# EAGLE design SwitchEthernet - Rev A6 (EAGLE 7.7.0)

## Sheet 1 of 2
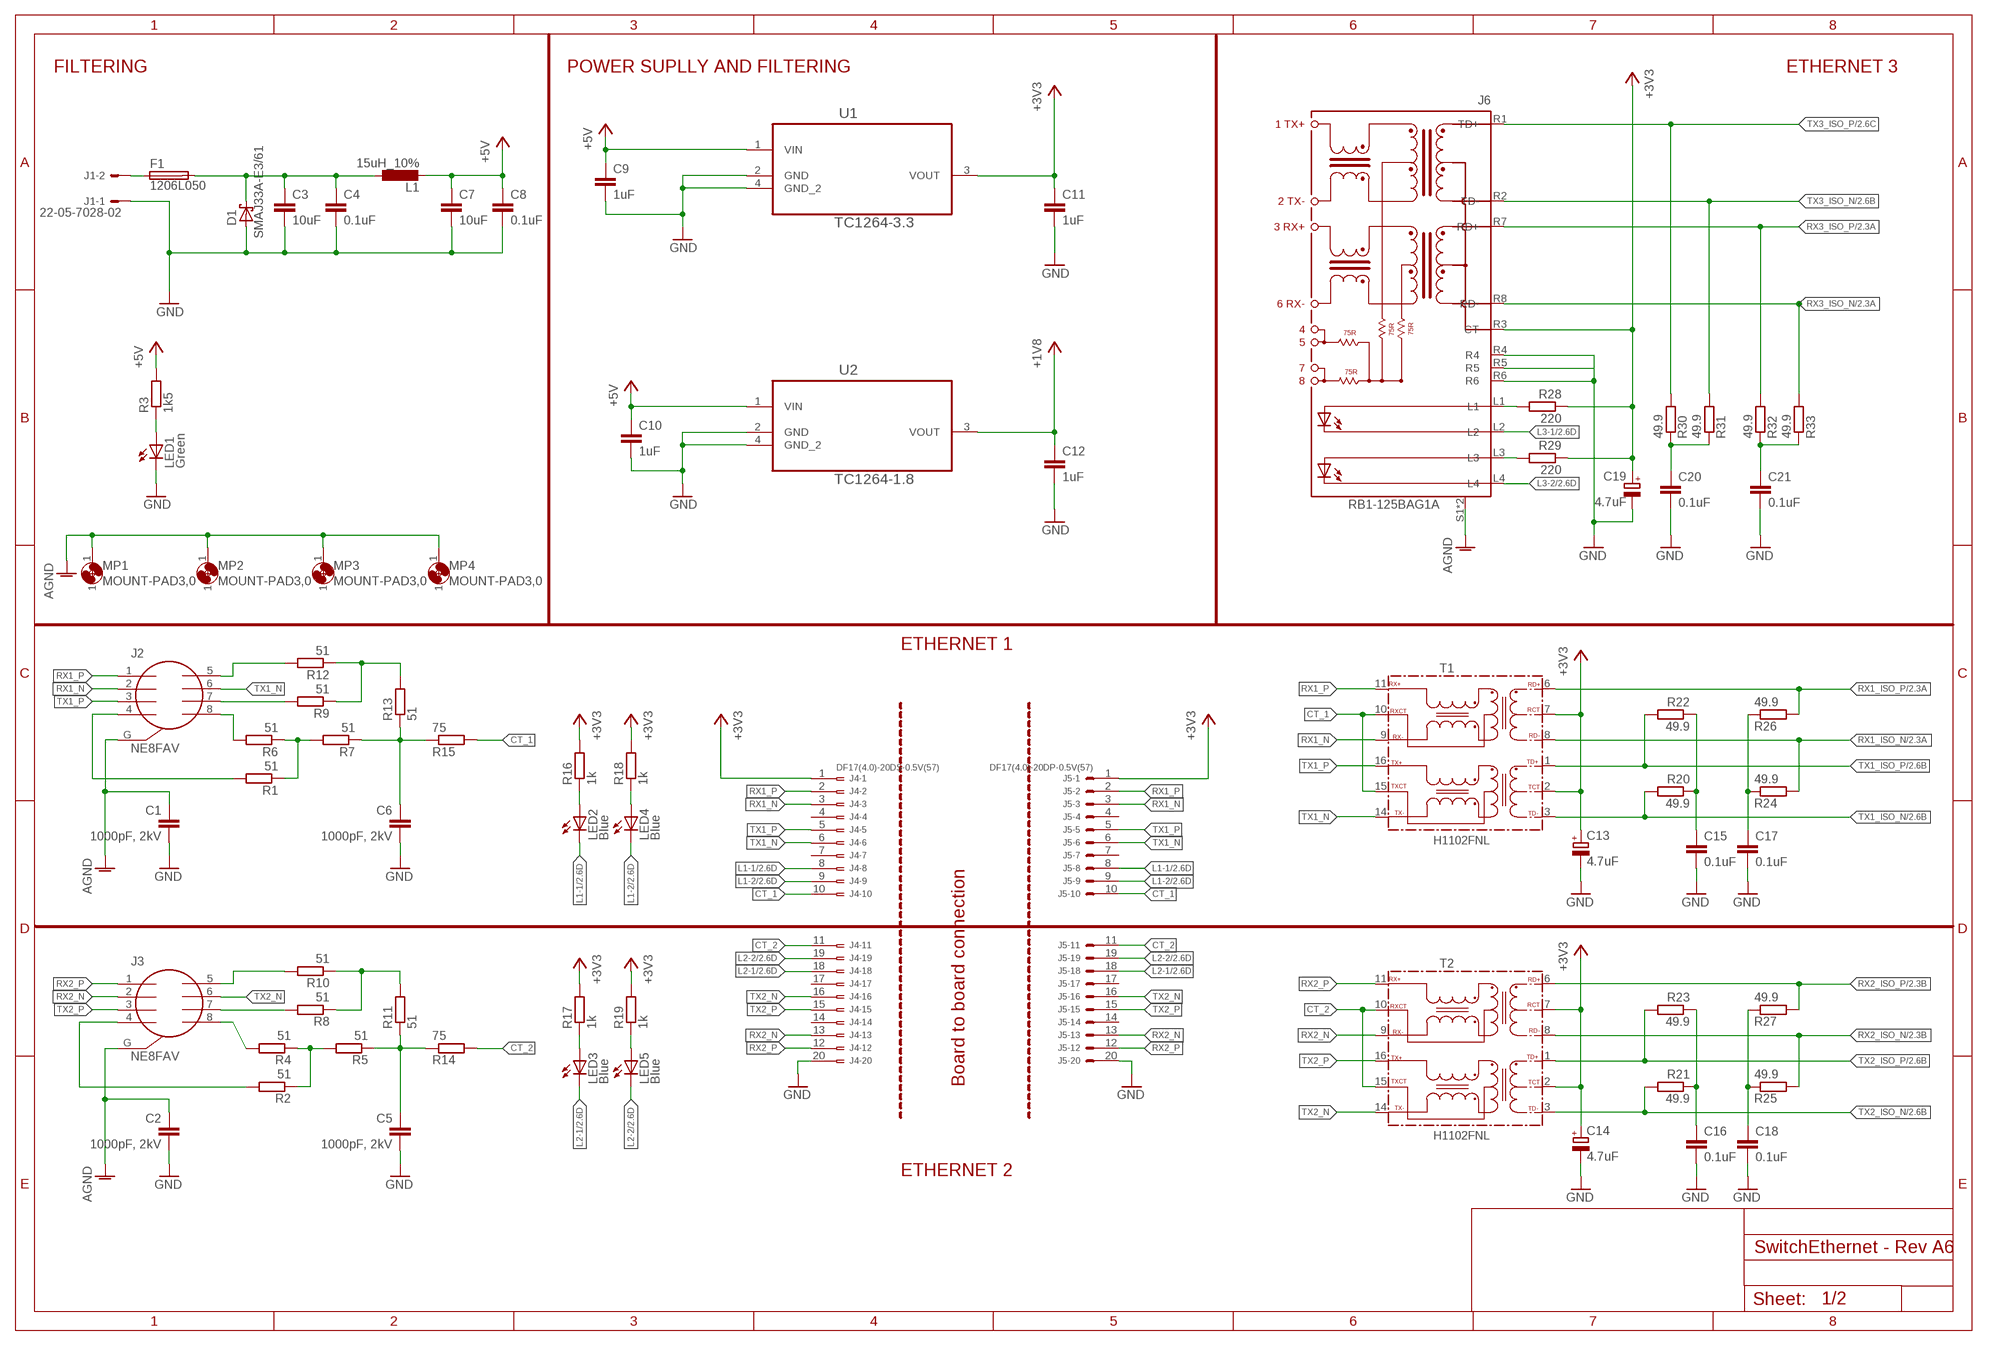
[diagram p0: schematic, sheet 1]

### Parts
C1  1000pF, 2kV  C-EUC1206  [C1206]
C2  1000pF, 2kV  C-EUC1206  [C1206]
C3  10uF  C-EUC0603  [C0603]
C4  0.1uF  C-EUC0603  [C0603]
C5  1000pF, 2kV  C-EUC1206  [C1206]
C6  1000pF, 2kV  C-EUC1206  [C1206]
C7  10uF  C-EUC0603  [C0603]
C8  0.1uF  C-EUC0603  [C0603]
C9  1uF  C-EUC0603  [C0603]
C10  1uF  C-EUC0603  [C0603]
C11  1uF  C-EUC0603  [C0603]
C12  1uF  C-EUC0603  [C0603]
C13  4.7uF  CPOL-EUCT3216  [CT3216]
C14  4.7uF  CPOL-EUCT3216  [CT3216]
C15  0.1uF  C-EUC0603  [C0603]
C16  0.1uF  C-EUC0603  [C0603]
C17  0.1uF  C-EUC0603  [C0603]
C18  0.1uF  C-EUC0603  [C0603]
C19  4.7uF  CPOL-EUCT3216  [CT3216]
C20  0.1uF  C-EUC0603  [C0603]
C21  0.1uF  C-EUC0603  [C0603]
D1  SMAJ33A-E3/61  [DIODE_DO-214AC]
F1  1206L050  [1206L]
J1  22-05-7028-02  [7395-02]
J2  NE8FAV  [NE8FAV]
J3  NE8FAV  [NE8FAV]
J4  DF17(4.0)-20DS-0.5V(57)  [DF17-20DS]
J5  DF17(4.0)-20DP-0.5V(57)  [DF17-20DP]
J6  RB1-125BAG1A  [WIZNET_RB1-125BAG1A]
L1  15uH_10%  L-EUL4532C  [L4532M]
LED1  Green  LEDCHIP-LED0603  [CHIP-LED0603]
LED2  Blue  LEDCHIP-LED0603  [CHIP-LED0603]
LED3  Blue  LEDCHIP-LED0603  [CHIP-LED0603]
LED4  Blue  LEDCHIP-LED0603  [CHIP-LED0603]
LED5  Blue  LEDCHIP-LED0603  [CHIP-LED0603]
MP1  MOUNT-PAD3,0  [P3,0]
MP2  MOUNT-PAD3,0  [P3,0]
MP3  MOUNT-PAD3,0  [P3,0]
MP4  MOUNT-PAD3,0  [P3,0]
R1  51  R-EU_R0603  [R0603]
R2  51  R-EU_R0603  [R0603]
R3  1k5  R-EU_R0603  [R0603]
R4  51  R-EU_R0603  [R0603]
R5  51  R-EU_R0603  [R0603]
R6  51  R-EU_R0603  [R0603]
R7  51  R-EU_R0603  [R0603]
R8  51  R-EU_R0603  [R0603]
R9  51  R-EU_R0603  [R0603]
R10  51  R-EU_R0603  [R0603]
R11  51  R-EU_R0603  [R0603]
R12  51  R-EU_R0603  [R0603]
R13  51  R-EU_R0603  [R0603]
R14  75  R-EU_R0603  [R0603]
R15  75  R-EU_R0603  [R0603]
R16  1k  R-EU_R0603  [R0603]
R17  1k  R-EU_R0603  [R0603]
R18  1k  R-EU_R0603  [R0603]
R19  1k  R-EU_R0603  [R0603]
R20  49.9  R-EU_R0603  [R0603]
R21  49.9  R-EU_R0603  [R0603]
R22  49.9  R-EU_R0603  [R0603]
R23  49.9  R-EU_R0603  [R0603]
R24  49.9  R-EU_R0603  [R0603]
R25  49.9  R-EU_R0603  [R0603]
R26  49.9  R-EU_R0603  [R0603]
R27  49.9  R-EU_R0603  [R0603]
R28  220  R-EU_R0603  [R0603]
R29  220  R-EU_R0603  [R0603]
R30  49.9  R-EU_R0603  [R0603]
R31  49.9  R-EU_R0603  [R0603]
R32  49.9  R-EU_R0603  [R0603]
R33  49.9  R-EU_R0603  [R0603]
T1  H1102FNL  [HXXXX]
T2  H1102FNL  [HXXXX]
U1  TC1264-3.3  [SOT230P700X180-4N]
U2  TC1264-1.8  [SOT230P700X180-4N]

### Nets
+1V8: C12.1 U2.3(VOUT) ; also sheet 2
+3V3: C11.1 C13.+ C14.+ C19.+ J4.1 J5.1 J6.R3(CT) R16.2 R17.2 R18.2 R19.2 R28.1 R29.1 T1.2(TCT) T1.7(RCT) T2.2(TCT) T2.7(RCT) U1.3(VOUT) ; also sheet 2
+5V: C7.1 C8.1 C9.1 C10.1 L1.2 R3.2 U1.1(VIN) U2.1(VIN)
AGND: C1.1 C2.1 J2.G J3.G J6.S1 J6.S2 MP1.1 MP2.1 MP3.1 MP4.1
CT_1: J4.10 J5.10 R15.2 T1.10(RXCT) T1.15(TXCT)
CT_2: J4.11 J5.11 R14.2 T2.10(RXCT) T2.15(TXCT)
GND: C1.2 C2.2 C3.2 C4.2 C5.2 C6.2 C7.2 C8.2 C9.2 C10.2 C11.2 C12.2 C13.- C14.- C15.2 C16.2 C17.2 C18.2 C19.- C20.2 C21.2 D1.2(A) J1.1 J4.20 J5.20 J6.R4 J6.R5 J6.R6 LED1.C U1.2(GND) U1.4(GND_2) U2.2(GND) U2.4(GND_2) ; also sheet 2
L1-1: J4.8 J5.8 LED2.C ; also sheet 2
L1-2: J4.9 J5.9 LED4.C ; also sheet 2
L2-1: J4.18 J5.18 LED3.C ; also sheet 2
L2-2: J4.19 J5.19 LED5.C ; also sheet 2
L3-1: J6.L2 ; also sheet 2
L3-2: J6.L4 ; also sheet 2
N$2: F1.1 J1.2
N$5: J3.8 R4.2
N$7: J2.4 R1.2
N$8: J2.8 R6.2
N$9: J2.7 R9.2
N$10: C15.1 R20.1 R22.1
N$11: J2.5 R12.2
N$12: J3.7 R8.2
N$13: C5.1 R5.1 R11.1 R14.1
N$14: R1.1 R6.1 R7.2
N$15: J3.4 R2.2
N$16: R2.1 R4.1 R5.2
N$17: R9.1 R12.1 R13.2
N$18: J3.5 R10.2
N$19: R8.1 R10.1 R11.2
N$20: LED2.A R16.1
N$23: LED1.A R3.1
N$27: C20.1 R30.1 R31.1
N$28: LED4.A R18.1
N$29: LED3.A R17.1
N$30: LED5.A R19.1
N$31: C21.1 R32.1 R33.1
N$32: C6.1 R7.1 R13.1 R15.1
N$33: C17.1 R24.1 R26.1
N$34: J6.L3 R29.2
N$35: J6.L1 R28.2
N$40: C16.1 R21.1 R23.1
N$41: C18.1 R25.1 R27.1
PW: C3.1 C4.1 D1.1(C) F1.2 L1.1
RX1_ISO_N: R24.2 T1.8(RD-) ; also sheet 2
RX1_ISO_P: R26.2 T1.6(RD+) ; also sheet 2
RX1_N: J2.2 J4.3 J5.3 T1.9(RX-)
RX1_P: J2.1 J4.2 J5.2 T1.11(RX+)
RX2_ISO_N: R25.2 T2.8(RD-) ; also sheet 2
RX2_ISO_P: R27.2 T2.6(RD+) ; also sheet 2
RX2_N: J3.2 J4.13 J5.13 T2.9(RX-)
RX2_P: J3.1 J4.12 J5.12 T2.11(RX+)
RX3_ISO_N: J6.R8(RD-) R33.2 ; also sheet 2
RX3_ISO_P: J6.R7(RD+) R32.2 ; also sheet 2
TX1_ISO_N: R20.2 T1.3(TD-) ; also sheet 2
TX1_ISO_P: R22.2 T1.1(TD+) ; also sheet 2
TX1_N: J2.6 J4.6 J5.6 T1.14(TX-)
TX1_P: J2.3 J4.5 J5.5 T1.16(TX+)
TX2_ISO_N: R21.2 T2.3(TD-) ; also sheet 2
TX2_ISO_P: R23.2 T2.1(TD+) ; also sheet 2
TX2_N: J3.6 J4.16 J5.16 T2.14(TX-)
TX2_P: J3.3 J4.15 J5.15 T2.16(TX+)
TX3_ISO_N: J6.R2(TD-) R31.2 ; also sheet 2
TX3_ISO_P: J6.R1(TD+) R30.2 ; also sheet 2
Unconnected: J4.4 J4.7 J4.14 J4.17 J5.4 J5.7 J5.14 J5.17

### Notes on the sheet
- FILTERING | POWER SUPLLY AND FILTERING | ETHERNET 3
- ETHERNET 1
- Board to board connection
- ETHERNET 2

## Sheet 2 of 2
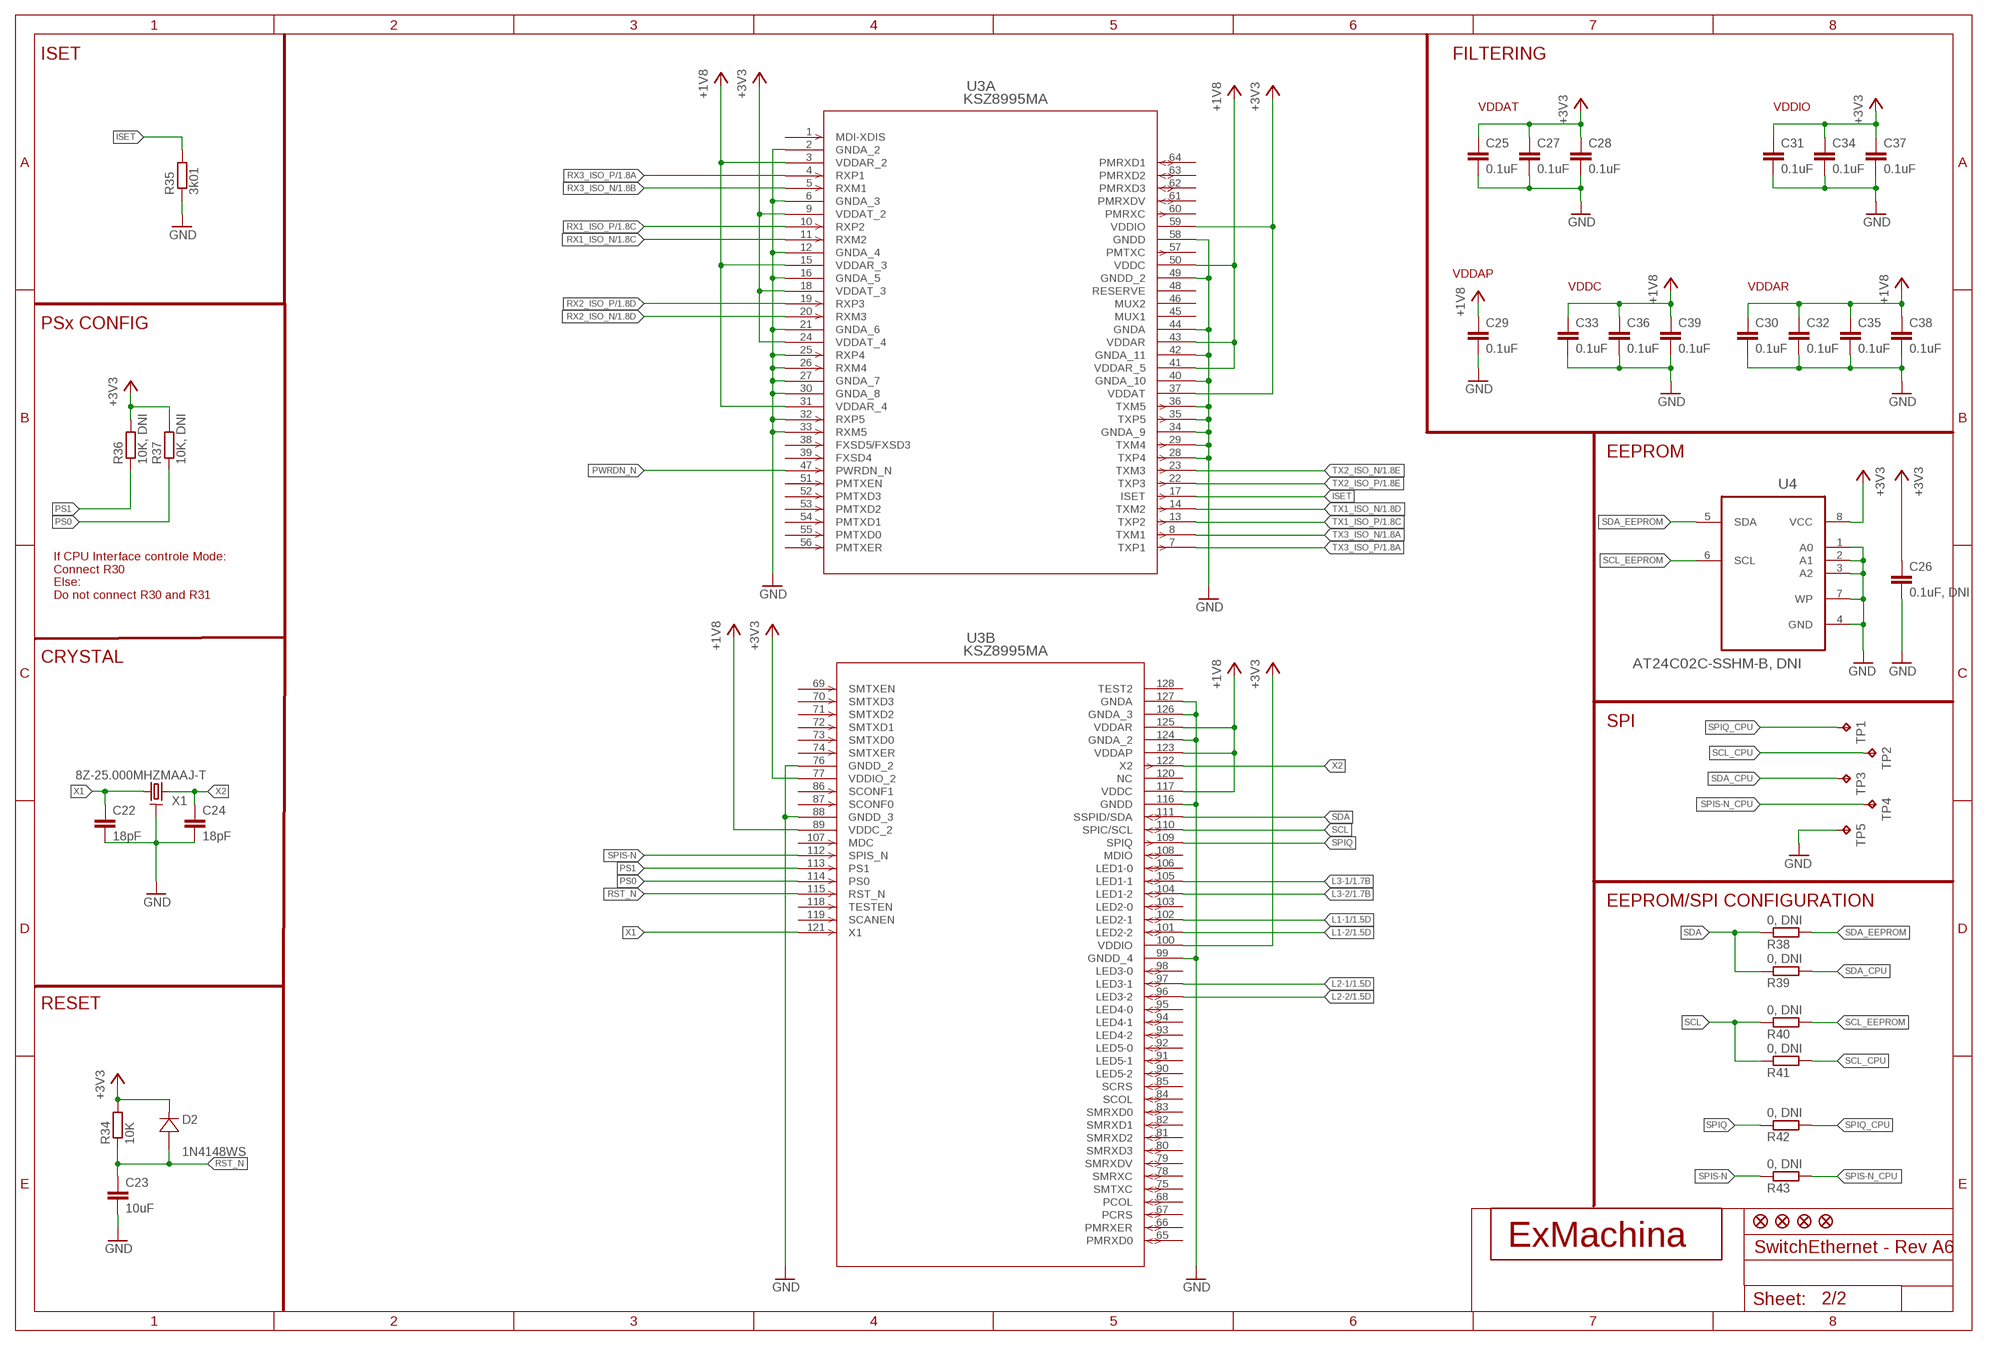
[diagram p1: schematic, sheet 2]

### Parts
C22  18pF  C-EUC0603  [C0603]
C23  10uF  C-EUC0603  [C0603]
C24  18pF  C-EUC0603  [C0603]
C25  0.1uF  C-EUC0603  [C0603]
C26  0.1uF, DNI  C-EUC0603  [C0603]
C27  0.1uF  C-EUC0603  [C0603]
C28  0.1uF  C-EUC0603  [C0603]
C29  0.1uF  C-EUC0603  [C0603]
C30  0.1uF  C-EUC0603  [C0603]
C31  0.1uF  C-EUC0603  [C0603]
C32  0.1uF  C-EUC0603  [C0603]
C33  0.1uF  C-EUC0603  [C0603]
C34  0.1uF  C-EUC0603  [C0603]
C35  0.1uF  C-EUC0603  [C0603]
C36  0.1uF  C-EUC0603  [C0603]
C37  0.1uF  C-EUC0603  [C0603]
C38  0.1uF  C-EUC0603  [C0603]
C39  0.1uF  C-EUC0603  [C0603]
D2  1N4148WS  [SOD323-W]
JP1  FIDUCIAL1X2  [FIDUCIAL-1X2]
JP2  FIDUCIAL1X2  [FIDUCIAL-1X2]
JP3  FIDUCIAL1X2  [FIDUCIAL-1X2]
JP4  FIDUCIAL1X2  [FIDUCIAL-1X2]
R34  10K  R-EU_R0603  [R0603]
R35  3k01  R-EU_R0603  [R0603]
R36  10K, DNI  R-EU_R0603  [R0603]
R37  10K, DNI  R-EU_R0603  [R0603]
R38  0, DNI  R-EU_R0603  [R0603]
R39  0, DNI  R-EU_R0603  [R0603]
R40  0, DNI  R-EU_R0603  [R0603]
R41  0, DNI  R-EU_R0603  [R0603]
R42  0, DNI  R-EU_R0603  [R0603]
R43  0, DNI  R-EU_R0603  [R0603]
T3  EXMACHINA-LOGO-NAME  [EXM-LOGO-BASELINE]
TP1  TPB1,27  [B1,27]
TP2  TPB1,27  [B1,27]
TP3  TPB1,27  [B1,27]
TP4  TPB1,27  [B1,27]
TP5  TPB1,27  [B1,27]
U3  KSZ8995MA  [PQFP-128_MQL]
U4  AT24C02C-SSHM-B, DNI  AT24C02C-SSHM-B  [SOIC127P600X175-8N]
X1  8Z-25.000MHZMAAJ-T  [SMD2.5X2]

### Nets
+1V8: C29.1 C30.1 C32.1 C33.1 C35.1 C36.1 C38.1 C39.1 U3.3(A:VDDAR_2) U3.15(A:VDDAR_3) U3.31(A:VDDAR_4) U3.41(A:VDDAR_5) U3.43(A:VDDAR) U3.50(A:VDDC) U3.89(B:VDDC_2) U3.117(B:VDDC) U3.123(B:VDDAP) U3.125(B:VDDAR) ; also sheet 1
+3V3: C25.1 C26.1 C27.1 C28.1 C31.1 C34.1 C37.1 D2.C R34.2 R36.2 R37.2 U3.9(A:VDDAT_2) U3.18(A:VDDAT_3) U3.24(A:VDDAT_4) U3.37(A:VDDAT) U3.59(A:VDDIO) U3.77(B:VDDIO_2) U3.100(B:VDDIO) U4.8(VCC) ; also sheet 1
GND: C22.2 C23.2 C24.2 C25.2 C26.2 C27.2 C28.2 C29.2 C30.2 C31.2 C32.2 C33.2 C34.2 C35.2 C36.2 C37.2 C38.2 C39.2 R35.1 TP5.TP U3.2(A:GNDA_2) U3.6(A:GNDA_3) U3.12(A:GNDA_4) U3.16(A:GNDA_5) U3.21(A:GNDA_6) U3.25(A:RXP4) U3.26(A:RXM4) U3.27(A:GNDA_7) U3.28(A:TXP4) U3.29(A:TXM4) U3.30(A:GNDA_8) U3.32(A:RXP5) U3.33(A:RXM5) U3.34(A:GNDA_9) U3.35(A:TXP5) U3.36(A:TXM5) U3.40(A:GNDA_10) U3.42(A:GNDA_11) U3.44(A:GNDA) U3.49(A:GNDD_2) U3.58(A:GNDD) U3.76(B:GNDD_2) U3.88(B:GNDD_3) U3.99(B:GNDD_4) U3.116(B:GNDD) U3.124(B:GNDA_2) U3.126(B:GNDA_3) U3.127(B:GNDA) U4.1(A0) U4.2(A1) U4.3(A2) U4.4(GND) U4.7(WP) X1.2 X1.4 ; also sheet 1
ISET: R35.2 U3.17(A:ISET)
L1-1: U3.102(B:LED2-1) ; also sheet 1
L1-2: U3.101(B:LED2-2) ; also sheet 1
L2-1: U3.97(B:LED3-1) ; also sheet 1
L2-2: U3.96(B:LED3-2) ; also sheet 1
L3-1: U3.105(B:LED1-1) ; also sheet 1
L3-2: U3.104(B:LED1-2) ; also sheet 1
PS0: R37.1 U3.114(B:PS0)
PS1: R36.1 U3.113(B:PS1)
PWRDN_N: U3.47(A:PWRDN_N)
RST_N: C23.1 D2.A R34.1 U3.115(B:RST_N)
RX1_ISO_N: U3.11(A:RXM2) ; also sheet 1
RX1_ISO_P: U3.10(A:RXP2) ; also sheet 1
RX2_ISO_N: U3.20(A:RXM3) ; also sheet 1
RX2_ISO_P: U3.19(A:RXP3) ; also sheet 1
RX3_ISO_N: U3.5(A:RXM1) ; also sheet 1
RX3_ISO_P: U3.4(A:RXP1) ; also sheet 1
SCL: R40.1 R41.1 U3.110(B:SPIC/SCL)
SCL_CPU: R41.2 TP2.TP
SCL_EEPROM: R40.2 U4.6(SCL)
SDA: R38.1 R39.1 U3.111(B:SSPID/SDA)
SDA_CPU: R39.2 TP3.TP
SDA_EEPROM: R38.2 U4.5(SDA)
SPIQ: R42.1 U3.109(B:SPIQ)
SPIQ_CPU: R42.2 TP1.TP
SPIS-N: R43.1 U3.112(B:SPIS_N)
SPIS-N_CPU: R43.2 TP4.TP
TX1_ISO_N: U3.14(A:TXM2) ; also sheet 1
TX1_ISO_P: U3.13(A:TXP2) ; also sheet 1
TX2_ISO_N: U3.23(A:TXM3) ; also sheet 1
TX2_ISO_P: U3.22(A:TXP3) ; also sheet 1
TX3_ISO_N: U3.8(A:TXM1) ; also sheet 1
TX3_ISO_P: U3.7(A:TXP1) ; also sheet 1
X1: C22.1 U3.121(B:X1) X1.1
X2: C24.1 U3.122(B:X2) X1.3
Unconnected: U3.1(A:MDI-XDIS) U3.38(A:FXSD5/FXSD3) U3.39(A:FXSD4) U3.45(A:MUX1) U3.46(A:MUX2) U3.48(A:RESERVE) U3.51(A:PMTXEN) U3.52(A:PMTXD3) U3.53(A:PMTXD2) U3.54(A:PMTXD1) U3.55(A:PMTXD0) U3.56(A:PMTXER) U3.57(A:PMTXC) U3.60(A:PMRXC) U3.61(A:PMRXDV) U3.62(A:PMRXD3) U3.63(A:PMRXD2) U3.64(A:PMRXD1) U3.65(B:PMRXD0) U3.66(B:PMRXER) U3.67(B:PCRS) U3.68(B:PCOL) U3.69(B:SMTXEN) U3.70(B:SMTXD3) U3.71(B:SMTXD2) U3.72(B:SMTXD1) U3.73(B:SMTXD0) U3.74(B:SMTXER) U3.75(B:SMTXC) U3.78(B:SMRXC) U3.79(B:SMRXDV) U3.80(B:SMRXD3) U3.81(B:SMRXD2) U3.82(B:SMRXD1) U3.83(B:SMRXD0) U3.84(B:SCOL) U3.85(B:SCRS) U3.86(B:SCONF1) U3.87(B:SCONF0) U3.90(B:LED5-2) U3.91(B:LED5-1) U3.92(B:LED5-0) U3.93(B:LED4-2) U3.94(B:LED4-1) U3.95(B:LED4-0) U3.98(B:LED3-0) U3.103(B:LED2-0) U3.106(B:LED1-0) U3.107(B:MDC) U3.108(B:MDIO) U3.118(B:TESTEN) U3.119(B:SCANEN) U3.120(B:NC) U3.128(B:TEST2)

### Notes on the sheet
- ISET | FILTERING
- VDDAT | VDDIO
- VDDAP
- VDDC | VDDAR
- PSx CONFIG
- EEPROM
- If CPU Interface controle Mode:
  Connect R30
  Else:
  Do not connect R30 and R31
- CRYSTAL
- SPI
- EEPROM/SPI CONFIGURATION
- RESET

## Library data of the parts
C1 C2 C5 C6 = rcl:C-EU: CAPACITOR, European symbol; MF: MULTICOMP; MPN: MC1206B102K202CT; OC_FARNELL: 1855909; OC_NEWARK: unknown
C3 C7 C23 = rcl:C-EU: CAPACITOR, European symbol; MF: MURATA; MPN: GRM32DR71C106KA01L; OC_FARNELL: 2494299; OC_NEWARK: unknown
C4 C8 C15-C18 C20 C21 C25-C39 = rcl:C-EU: CAPACITOR, European symbol; MF: MURATA; MPN: GRM188R71H104KA93D; OC_FARNELL: 8820023; OC_NEWARK: unknown
C9-C12 = rcl:C-EU: CAPACITOR, European symbol; MF: MURATA; MPN: GRM188R61C105KA93D; OC_FARNELL: 1828801; OC_NEWARK: unknown
C13 C14 C19 = rcl:CPOL-EU: POLARIZED CAPACITOR, European symbol; MF: KEMET; MPN: T491A475K016AT; OC_FARNELL: 1457428; OC_NEWARK: unknown
C22 C24 = rcl:C-EU: CAPACITOR, European symbol; MF: MURATA; MPN: GRM1885C1H180JA01D; OC_FARNELL: 1828908; OC_NEWARK: unknown
D1 = diode:SMAJ33A-E3/61; MF: VISHAY; MPN: SMAJ33A-E3/61; OC_FARNELL: 9550909; OC_NEWARK: unknown
D2 = diode:1N4148WS; MF: ON SEMICONDUCTOR; MPN: 1N4148WS; OC_FARNELL: 2453269; OC_NEWARK: unknown
F1 = fuse2:1206L: 1206L Series - POLYFUSE® Lead-Free Surface Mount Resettable PPTC; MF: LITTELFUSE; MPN: 1206L050YR; OC_FARNELL: 1596993; OC_NEWARK: unknown
J1 = con-molex:22-?-02: CONNECTOR wire to board 2.54 mm (.1 inch) pitch header; MF: MOLEX; MPN: 22-05-7028; OC_FARNELL: 9731601; OC_NEWARK: unknown
J2 J3 = con-neutrik_ag:NE8; MF: NEUTRIK; MPN: NE8FAV; OC_FARNELL: 1202031; OC_NEWARK: unknown
J4 = con-hirose:DF17(?)-20DS-0.5V(57); MF: HIROSE(HRS); MPN: DF17(4.0)-20DS-0.5V(57); OC_FARNELL: 2300346; OC_NEWARK: unknown
J5 = con-hirose:DF17(?)-20DP-0.5V(57); MF: HIROSE(HRS); MPN: DF17(4.0)-20DP-0.5V(57); OC_FARNELL: 2300344; OC_NEWARK: unknown
J6 = con-wiznet:RB1-125BAG1A: Accessory RJ-45 With Transformer Connector - UDE; OC_FARNELL: unknown; OC_NEWARK: unknown
JP1-JP4 = SparkFun:FIDUCIAL: Fiducial Alignment Points Various fiducial points for machine vision alignment.; OC_FARNELL: unknown; OC_NEWARK: unknown
L1 = rcl:L-EU: INDUCTOR, European symbol; MF: MURATA; MPN: LQH43CN150K03L; OC_FARNELL: 1515461; OC_NEWARK: unknown
LED1 = led:LED: LED OSRAM: - CHIPLED LG R971, LG N971, LY N971, LG Q971, LY Q971, LO R971, LY R971 LH N974, LH R974 LS Q976, LO Q976, LY Q976 LO Q996 - Hyper CHIPLED LW Q18S LB Q993, LB Q99A, LB R99A - SideLED LS A670, LO A670, LY A670, LG A670, LP A670 LB A673, LV A673, LT A673, LW A673 LH A674 LY A675 LS A676, LA A676, LO A676, LY A676, LW A676 LS A679, LY A679, LG A679 - Hyper Micro SIDELED® LS Y876, LA Y876, LO Y876, LY Y876 LT Y87S - SmartLED LW L88C, LW L88S LB L89C, LB L89S, LG L890 LS L89K, LO L89K, LY L89K LS L896, LA L896, LO L896, LY L896 - TOPLED LS T670, LO T670, LY T670, LG T670, LP T670 LSG T670, LSP T670, LSY T670, LOP T670, LYG T670 LG T671, LOG T671, LSG T671 LB T673, LV T673, LT T673, LW T673 LH T674 LS T676, LA T676, LO T676, LY T676, LB T676, LH T676, LSB T676, LW T676 LB T67C, LV T67C, LT T67C, LS T67K, LO T67K, LY T67K, LW E67C LS E67B, LA E67B, LO E67B, LY E67B, LB E67C, LV E67C, LT E67C LW T67C LS T679, LY T679, LG T679 LS T770, LO T770, LY T770, LG T770, LP T770 LB T773, LV T773, LT T773, LW T773 LH T774 LS E675, LA E675, LY E675, LS T675 LS T776, LA T776, LO T776, LY T776, LB T776 LHGB T686 LT T68C, LB T68C - Hyper Mini TOPLED® LB M676 - Mini TOPLED Santana® LG M470 LS M47K, LO M47K, LY M47K Source: http://www.osram.convergy.de LUXEON: - LUMILED® LXK2-PW12-R00, LXK2-PW12-S00, LXK2-PW14-U00, LXK2-PW14-V00 LXK2-PM12-R00, LXK2-PM12-S00, LXK2-PM14-U00 LXK2-PE12-Q00, LXK2-PE12-R00, LXK2-PE12-S00, LXK2-PE14-T00, LXK2-PE14-U00 LXK2-PB12-K00, LXK2-PB12-L00, LXK2-PB12-M00, LXK2-PB14-N00, LXK2-PB14-P00, LXK2-PB14-Q00 LXK2-PR12-L00, LXK2-PR12-M00, LXK2-PR14-Q00, LXK2-PR14-R00 LXK2-PD12-Q00, LXK2-PD12-R00, LXK2-PD12-S00 LXK2-PH12-R00, LXK2-PH12-S00 LXK2-PL12-P00, LXK2-PL12-Q00, LXK2-PL12-R00 Source: www.luxeon.com KINGBRIGHT: KA-3528ASYC Source: www.kingbright.com; MF: MULTICOMP; MPN: OVS-0604; OC_FARNELL: 1716771; OC_NEWARK: unknown
LED2-LED5 = led:LED: LED OSRAM: - CHIPLED LG R971, LG N971, LY N971, LG Q971, LY Q971, LO R971, LY R971 LH N974, LH R974 LS Q976, LO Q976, LY Q976 LO Q996 - Hyper CHIPLED LW Q18S LB Q993, LB Q99A, LB R99A - SideLED LS A670, LO A670, LY A670, LG A670, LP A670 LB A673, LV A673, LT A673, LW A673 LH A674 LY A675 LS A676, LA A676, LO A676, LY A676, LW A676 LS A679, LY A679, LG A679 - Hyper Micro SIDELED® LS Y876, LA Y876, LO Y876, LY Y876 LT Y87S - SmartLED LW L88C, LW L88S LB L89C, LB L89S, LG L890 LS L89K, LO L89K, LY L89K LS L896, LA L896, LO L896, LY L896 - TOPLED LS T670, LO T670, LY T670, LG T670, LP T670 LSG T670, LSP T670, LSY T670, LOP T670, LYG T670 LG T671, LOG T671, LSG T671 LB T673, LV T673, LT T673, LW T673 LH T674 LS T676, LA T676, LO T676, LY T676, LB T676, LH T676, LSB T676, LW T676 LB T67C, LV T67C, LT T67C, LS T67K, LO T67K, LY T67K, LW E67C LS E67B, LA E67B, LO E67B, LY E67B, LB E67C, LV E67C, LT E67C LW T67C LS T679, LY T679, LG T679 LS T770, LO T770, LY T770, LG T770, LP T770 LB T773, LV T773, LT T773, LW T773 LH T774 LS E675, LA E675, LY E675, LS T675 LS T776, LA T776, LO T776, LY T776, LB T776 LHGB T686 LT T68C, LB T68C - Hyper Mini TOPLED® LB M676 - Mini TOPLED Santana® LG M470 LS M47K, LO M47K, LY M47K Source: http://www.osram.convergy.de LUXEON: - LUMILED® LXK2-PW12-R00, LXK2-PW12-S00, LXK2-PW14-U00, LXK2-PW14-V00 LXK2-PM12-R00, LXK2-PM12-S00, LXK2-PM14-U00 LXK2-PE12-Q00, LXK2-PE12-R00, LXK2-PE12-S00, LXK2-PE14-T00, LXK2-PE14-U00 LXK2-PB12-K00, LXK2-PB12-L00, LXK2-PB12-M00, LXK2-PB14-N00, LXK2-PB14-P00, LXK2-PB14-Q00 LXK2-PR12-L00, LXK2-PR12-M00, LXK2-PR14-Q00, LXK2-PR14-R00 LXK2-PD12-Q00, LXK2-PD12-R00, LXK2-PD12-S00 LXK2-PH12-R00, LXK2-PH12-S00 LXK2-PL12-P00, LXK2-PL12-Q00, LXK2-PL12-R00 Source: www.luxeon.com KINGBRIGHT: KA-3528ASYC Source: www.kingbright.com; MF: MULTICOMP; MPN: OVS-0603; OC_FARNELL: 1716770; OC_NEWARK: unknown
MP1-MP4 = holes:MOUNT-PAD: MOUNTING HOLE with drill center marker; OC_FARNELL: unknown; OC_NEWARK: unknown
R1 R2 R4-R13 = rcl:R-EU_: RESISTOR, European symbol; MF: YAGEO; MPN: RC0603FR-0751RL; OC_FARNELL: 1799350; OC_NEWARK: unknown
R3 = rcl:R-EU_: RESISTOR, European symbol; MF: YAGEO; MPN: RC0603FR-071K5L; OC_FARNELL: 2126808; OC_NEWARK: unknown
R14 R15 = rcl:R-EU_: RESISTOR, European symbol; MF: YAGEO; MPN: RC0603FR-0775RL; OC_FARNELL: 1799355; OC_NEWARK: unknown
R16-R19 = rcl:R-EU_: RESISTOR, European symbol; MF: YAGEO; MPN: RC0603FR-071KL.; OC_FARNELL: 2132444; OC_NEWARK: unknown
R20-R27 R30-R33 = rcl:R-EU_: RESISTOR, European symbol; MF: MULTICOMP; MPN: MCWR06X49R9FTL; OC_FARNELL: 2447381; OC_NEWARK: unknown
R28 R29 = rcl:R-EU_: RESISTOR, European symbol; MF: YAGEO (PHYCOMP); MPN: RC0603FR-07220RL; OC_FARNELL: 9238409; OC_NEWARK: unknown
R34 R36 R37 = rcl:R-EU_: RESISTOR, European symbol; MF: YAGEO; MPN: RC0603FR-0710KL; OC_FARNELL: 2133286; OC_NEWARK: unknown
R35 = rcl:R-EU_: RESISTOR, European symbol; MF: MULTICOMP; MPN: MCMR06X3001FTL; OC_FARNELL: 2073461; OC_NEWARK: unknown
R38-R43 = rcl:R-EU_: RESISTOR, European symbol; MF: YAGEO; MPN: RC0603FR-070RL; OC_FARNELL: 2309106; OC_NEWARK: unknown
T1 T2 = pulse:H1102FNL; OC_FARNELL: unknown; OC_NEWARK: unknown
T3 = exmachina:EXMACHINA-LOGO; OC_FARNELL: unknown; OC_NEWARK: unknown
TP1-TP5 = testpad:TP: Test pad; OC_FARNELL: unknown; OC_NEWARK: unknown
U1 = microchip-6:TC1264-3.3: IC, 8 00mA Fixed Output CMOS LDO,3.3V,SOT-223, 3-lead; OC_FARNELL: unknown; OC_NEWARK: unknown
U2 = microchip-6:TC1264-1.8: IC, 800mA Fixed Output CMOS LDO,1.8V,SOT-223, 3-lead; OC_FARNELL: unknown; OC_NEWARK: unknown
U3 = Micrel_By_element14_Batch_1:KSZ8995MA: 5 Port 10/100 Switch with PHY; MF: MICROCHIP; MPN: KSZ8995MA; OC_FARNELL: 2509844; OC_NEWARK: unknown
U4 = atmel:AT24C02C-SSHM-B: SERIAL EEPROM IC Memory Size:2Kbit,8-SOIC; MF: MICROCHIP; MPN: AT24C02C-SSHM-B; OC_FARNELL: 1971995
X1 = crystal:8Z; MF: TXC; MPN: 8Z-25.000MAAJ-T; OC_FARNELL: 1842189; OC_NEWARK: unknown

## Board
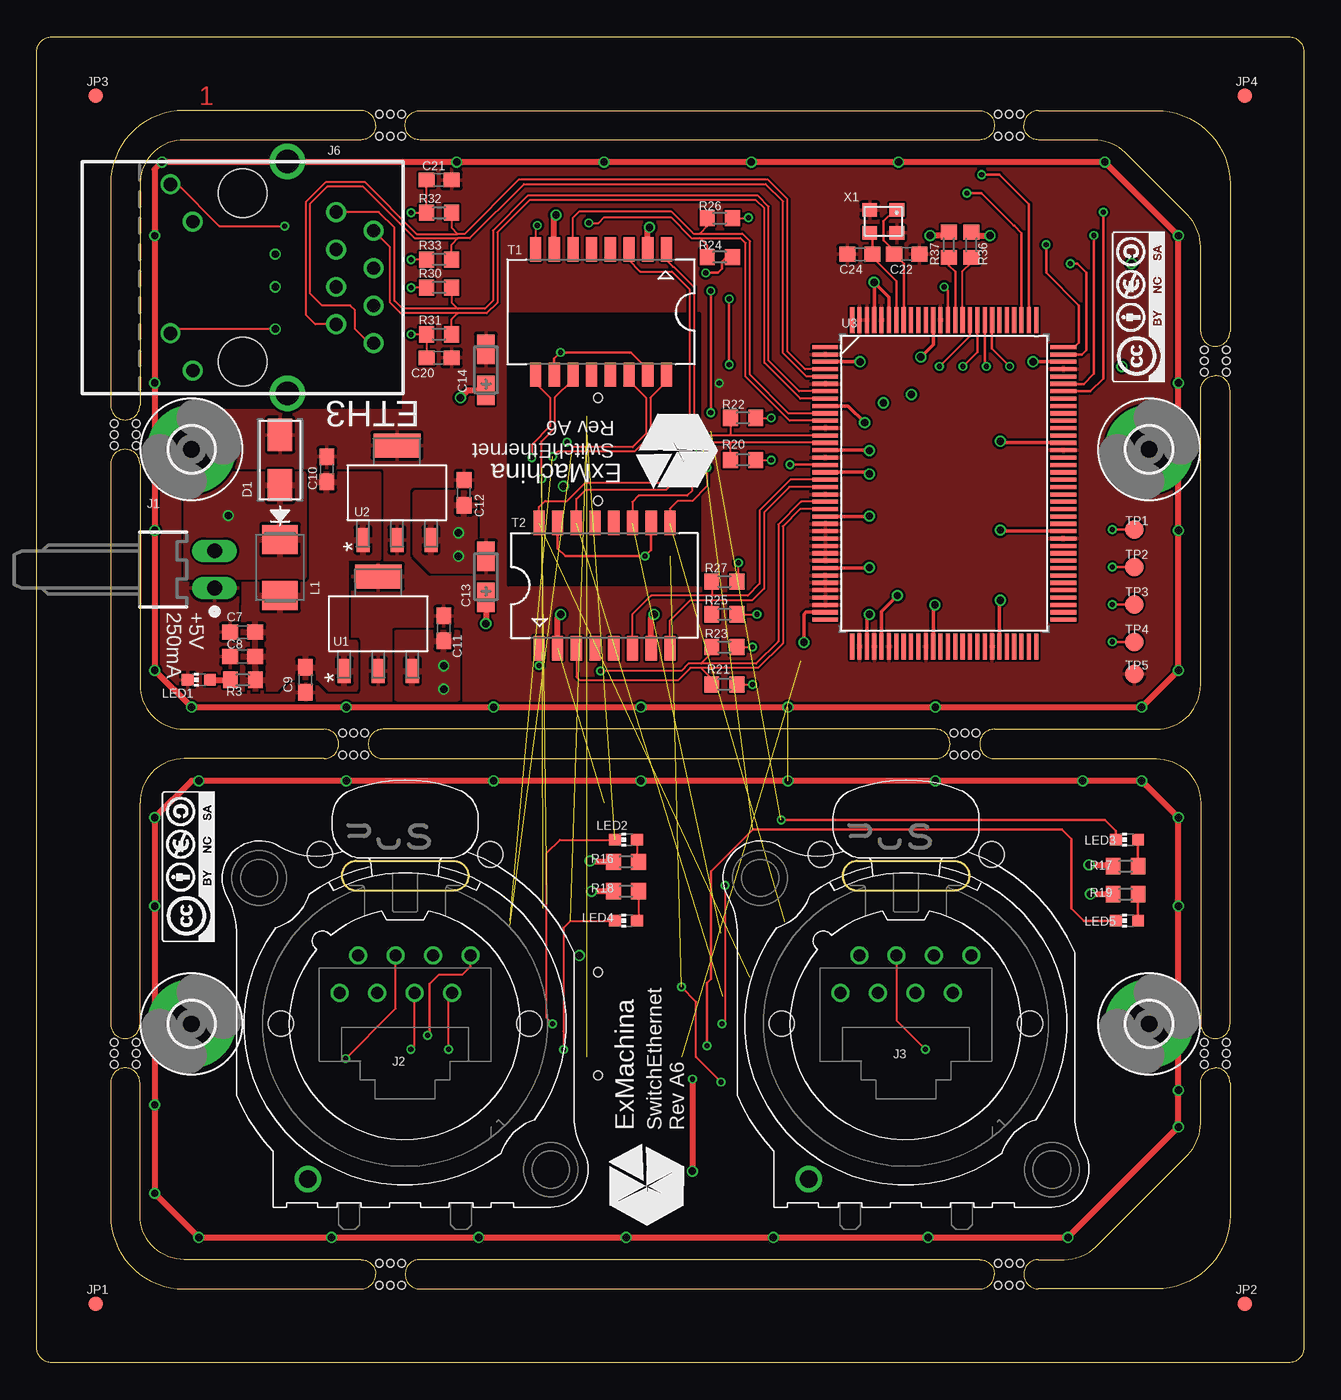
[diagram p2: board, top side]
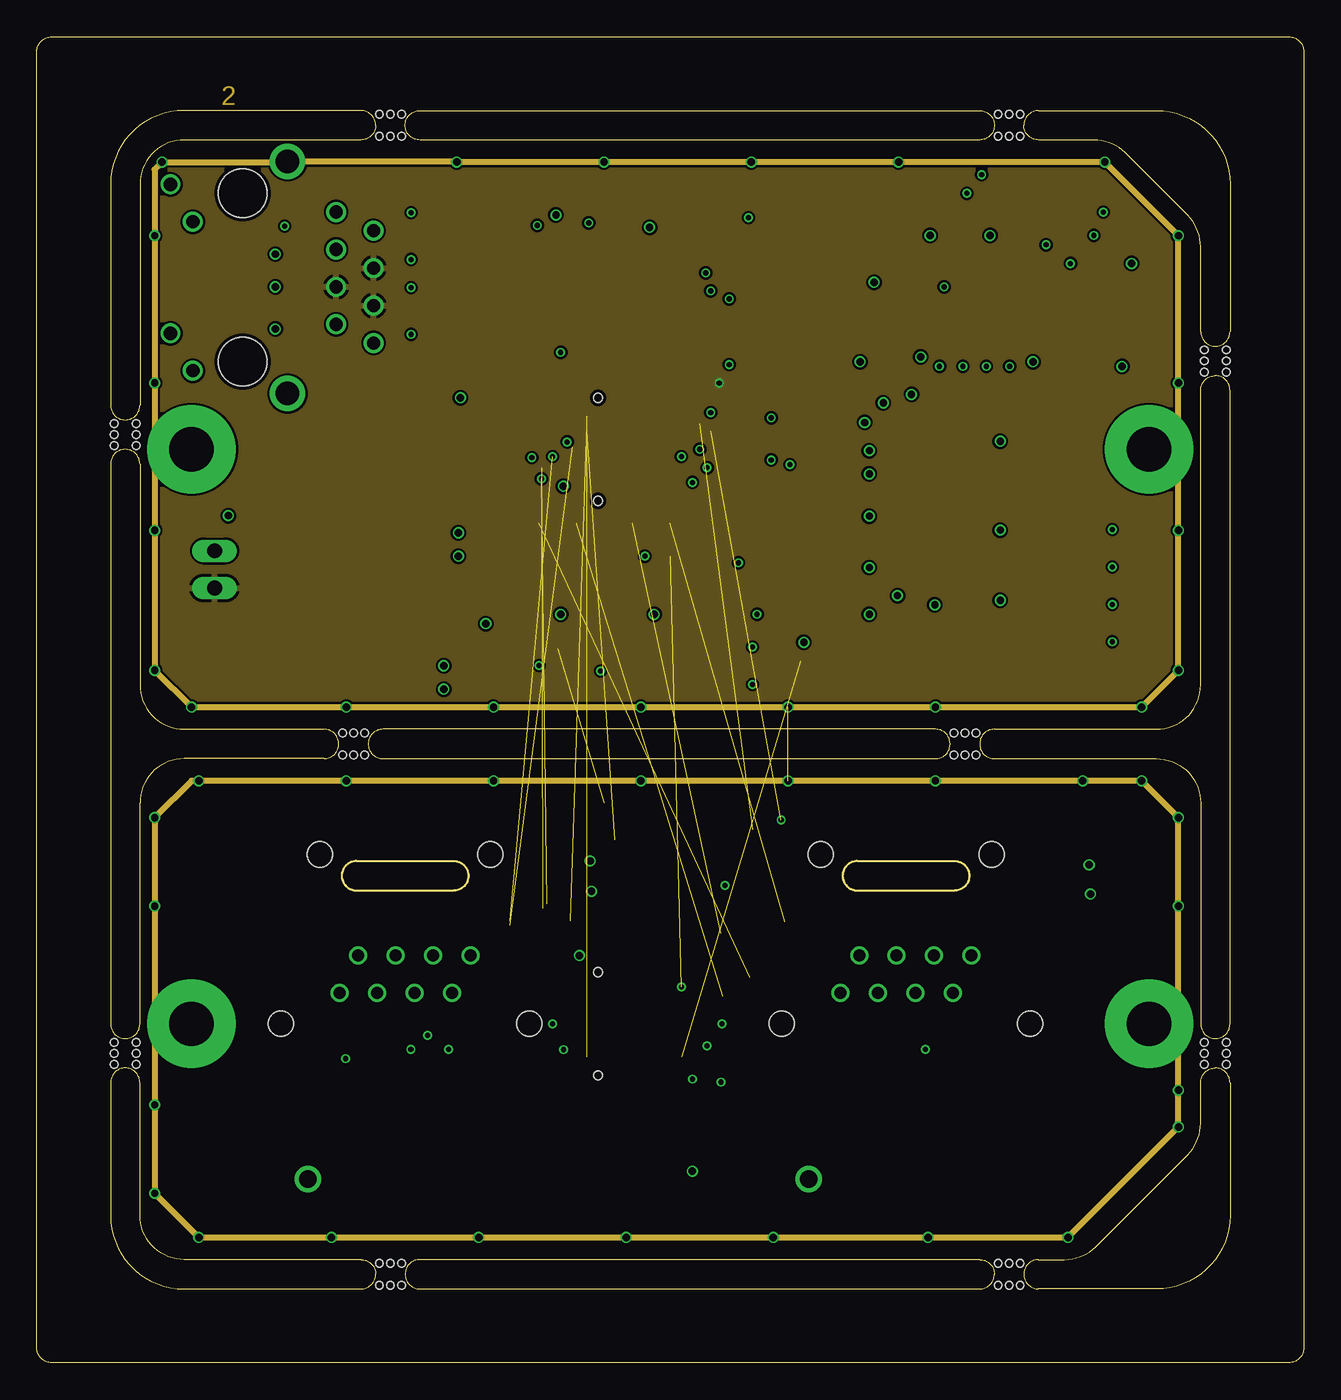
[diagram p3: board, inner layer Route2]
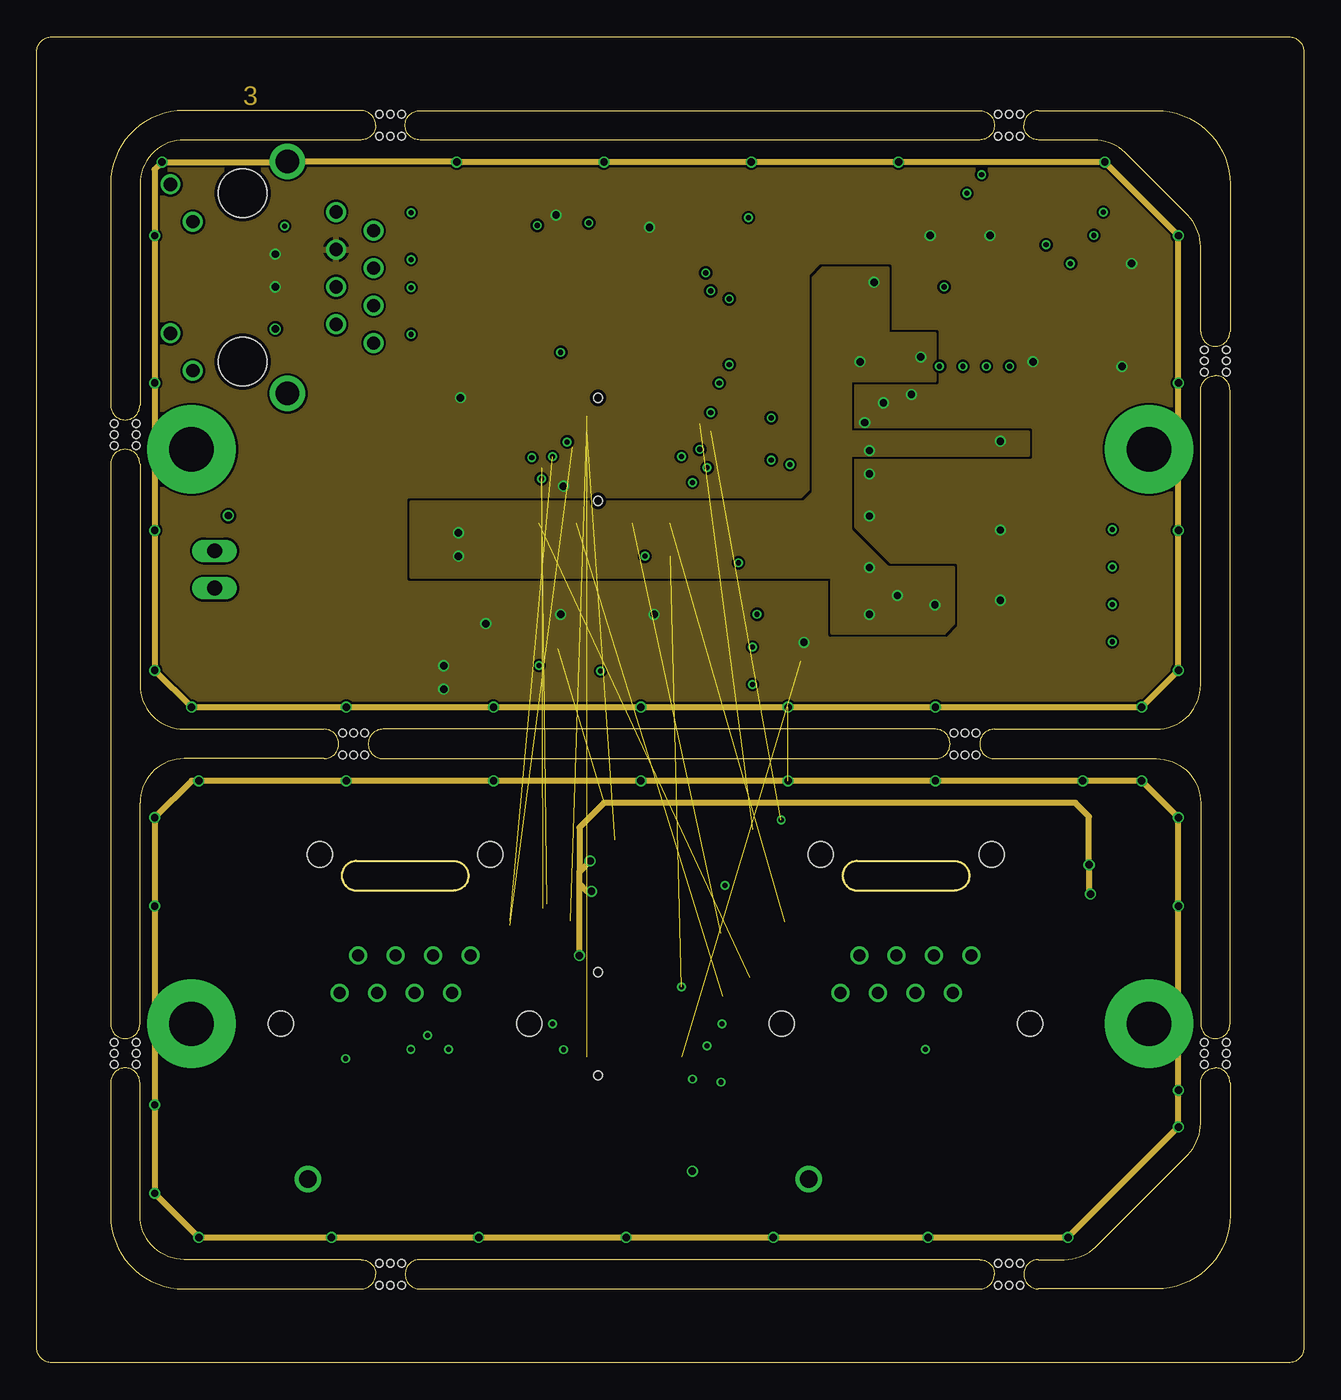
[diagram p4: board, inner layer Route15]
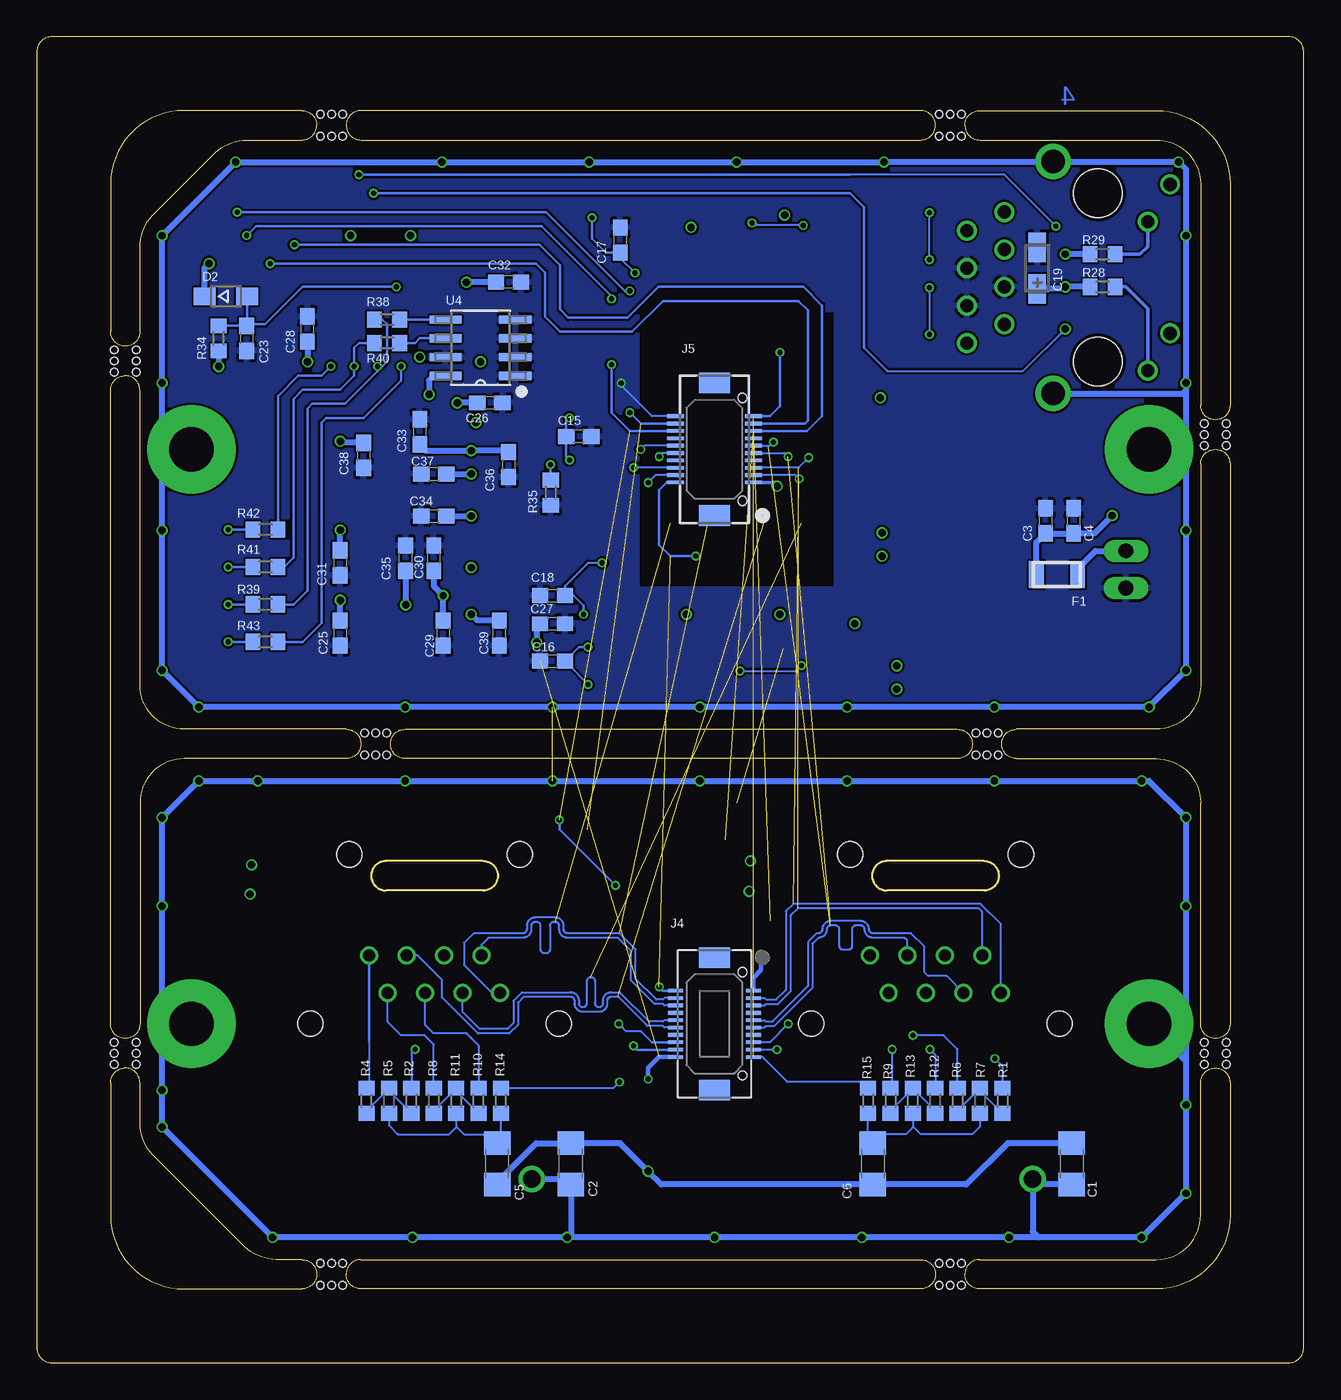
[diagram p5: board, bottom side, seen from below]

Size 86 x 90 mm. Coordinates in mm from the lower left corner, seen from the top.
Outline: 68,7 69.76,7 arc45 71.88,7.88 78.12,14.12 arc45 79,16.24 79,19 arc-90 80,20 arc-90 81,19 81,10 arc-90 76,5 68,5 arc-90 67,6 arc-90 68,7
Outline: 64,7 26,7 arc90 25,6 arc90 26,5 64,5 arc90 65,6 arc90 64,7
Outline: 22,7 10,7 arc-90 7,10 7,19 arc90 6,20 arc90 5,19 5,10 arc90 10,5 22,5 arc90 23,6 arc90 22,7
Outline: 7,61 7,46 arc90 10,43 19.5,43 arc-90 20.5,42 arc-90 19.5,41 10,41 arc90 7,38 7,23 arc-90 6,22 arc-90 5,23 5,61 arc-90 6,62 arc-90 7,61
Outline: 65,43 76,43 arc90 79,46 79,66 arc-90 80,67 arc-90 81,66 81,23 arc-90 80,22 arc-90 79,23 79,38 arc90 76,41 65,41 arc-90 64,42 arc-90 65,43
Outline: 79,70 79,75.76 arc45 78.12,77.88 73.88,82.12 arc45 71.76,83 68,83 arc-90 67,84 arc-90 68,85 76,85 arc-90 81,80 81,70 arc-90 80,69 arc-90 79,70
Outline: 22,85 10,85 arc90 5,80 5,65 arc90 6,64 arc90 7,65 7,80 arc-90 10,83 22,83 arc90 23,84 arc90 22,85
Outline: 65,84 arc-90 64,83 26,83 arc-90 25,84 arc-90 26,85 64,85 arc-90 65,84
Outline: 0,1 0,89 arc-90 1,90 85,90 arc-90 86,89 86,1 arc-90 85,0 1,0 arc-90 0,1
Outline: 61,41 arc90 62,42 arc90 61,43 23.5,43 arc90 22.5,42 arc90 23.5,41 61,41
Copper layers (1+2*15+16): Top 0.018mm / dielectric 0.36mm / Route2 0.035mm / dielectric 0.71mm / Route15 0.035mm / dielectric 0.2mm / Bottom 0.018mm
Design rules "eC_4Layer_PClass6_BaseCopperO18-I35_eCDefault *": minimum track width 0.15mm, minimum drill 0.35mm, track to track 0.15mm, track to pad 0.15mm, pad to pad 0.15mm, via to via 0.15mm, smd to smd 0mil, copper to edge 0.25mm, drill to drill 0.35mm, minimum pad ring 0.175mm, minimum via ring 0.125mm, stop-mask expansion 0mil, vias tented up to drill 0.45mm, thermal gap 0.2mm
Holes 0.5 mm at 5.25,62.25 5.25,63 5.25,63.75 6.75,63.75 6.75,63 6.75,62.25 24,84.75 23.25,84.75 24.75,84.75 23.25,83.25 24,83.25 24.75,83.25 65.25,84.75 66,84.75 66.75,84.75 65.25,83.25 66,83.25 66.75,83.25 79.25,68 79.25,68.75 79.25,67.25 80.75,67.25 80.75,68 80.75,68.75 79.25,21.75 79.25,21 79.25,20.25 80.75,20.25 80.75,21 80.75,21.75 66,6.75 65.25,6.75 66.75,6.75 66,5.25 66.75,5.25 65.25,5.25 24,6.75 24.75,6.75 23.25,6.75 23.25,5.25 24,5.25 24.75,5.25 5.25,21 5.25,21.75 5.25,20.25 6.75,20.25 6.75,21 6.75,21.75 62.25,41.25 63,41.25 63.75,41.25 63.75,42.75 63,42.75 62.25,42.75 20.75,41.25 21.5,41.25 22.25,41.25 22.25,42.75 21.5,42.75 20.75,42.75

### Footprints (pad centres in the part's own frame; a part is rotated, then mirrored left to right if it is on the bottom)
C1206 = smd 1.6 x 1.8: 1 -1.4,0; 2 1.4,0
C0603 = smd 1.1 x 1: 1 -0.85,0; 2 0.85,0
CT3216 = smd 2 x 1.2: + -1.4,0; - 1.4,0
DIODE_DO-214AC = smd 2.184 x 1.651: 1 -1.702,0; 2 1.702,0
SOD323-W = smd 1.5 x 1.2: A 1.45,0; C -1.45,0
1206L = smd 1 x 1.8: 1 -1.4,0; 2 1.4,0
7395-02 = drill 1.016 long: 1 1.27,0; 2 -1.27,0
NE8FAV = drill 0.813: 1 -4.445,2.108; 2 -3.175,4.648; 3 -1.905,2.108; 4 -0.635,4.648; 5 0.635,2.108; 6 1.905,4.648; 7 3.175,2.108; 8 4.445,4.648 | drill 1.194: G -6.604,-10.541 | hole 1.7: -8.425,0; 8.425,0; 5.8,11.5; -5.8,11.5
DF17-20DS = smd 0.25 x 1: 1 2.25,-2.65; 2 1.75,-2.65; 3 1.25,-2.65; 4 0.75,-2.65; 5 0.25,-2.65; 6 -0.25,-2.65; 7 -0.75,-2.65; 8 -1.25,-2.65; 9 -1.75,-2.65; 10 -2.25,-2.65; 11 2.25,2.65; 12 1.75,2.65; 13 1.25,2.65; 14 0.75,2.65; 15 0.25,2.65; 16 -0.25,2.65; 17 -0.75,2.65; 18 -1.25,2.65; 19 -1.75,2.65; 20 -2.25,2.65 | smd 1.4 x 2.1: G1 4.5,0; G2 -4.5,0 | hole 0.6: -3.5,-1.9; 3.5,-1.9
DF17-20DP = smd 0.25 x 1.15: 1 -2.25,-2.65; 2 -1.75,-2.65; 3 -1.25,-2.65; 4 -0.75,-2.65; 5 -0.25,-2.65; 6 0.25,-2.65; 7 0.75,-2.65; 8 1.25,-2.65; 9 1.75,-2.65; 10 2.25,-2.65; 11 -2.25,2.65; 12 -1.75,2.65; 13 -1.25,2.65; 14 -0.75,2.65; 15 -0.25,2.65; 16 0.25,2.65; 17 0.75,2.65; 18 1.25,2.65; 19 1.75,2.65; 20 2.25,2.65 | smd 1.4 x 2.1: G1 -4.5,0; G2 4.5,0 | hole 0.6: -3.5,-1.9; 3.5,-1.9
WIZNET_RB1-125BAG1A = drill 0.9: L1 6.325,-3.38; L2 3.784,-4.899; L3 -3.786,-3.379; L4 -6.325,-4.9 | drill 0.9 pad 1.3: R1 -4.446,6.349; R2 -3.176,8.889; R3 -1.906,6.349; R4 -0.636,8.889; R5 0.634,6.349; R6 1.904,8.889; R7 3.174,6.349; R8 4.444,8.889 | drill 1.6 pad 2.184: S1 -7.876,3.049; S2 7.874,3.049 | hole 3.3: 5.714,-0.001; -5.716,-0.001
FIDUCIAL-1X2 = smd 1 x 1: 1 0,0
L4532M = smd 2 x 2.4: 1 -1.9,0; 2 1.9,0
CHIP-LED0603 = smd 0.8 x 0.8: A 0,-0.75; C 0,0.75
P3,0 = drill 3 pad 6: 1 0,0
R0603 = smd 1 x 1.1: 1 -0.85,0; 2 0.85,0
HXXXX = smd 0.762 x 1.651: 1 -4.445,-4.255; 2 -3.175,-4.255; 3 -1.905,-4.255; 4 -0.635,-4.255; 5 0.635,-4.255; 6 1.905,-4.255; 7 3.175,-4.255; 8 4.445,-4.255; 9 4.445,4.255; 10 3.175,4.255; 11 1.905,4.255; 12 0.635,4.255; 13 -0.635,4.255; 14 -1.905,4.255; 15 -3.175,4.255; 16 -4.445,4.255
B1,27 = smd 1.27 x 1.27: TP 0,0
SOT230P700X180-4N = smd 1.626 x 0.889: 1 -3.2,2.311; 2 -3.2,0; 3 -3.2,-2.311 | smd 1.626 x 3.175: 4 3.2,0
PQFP-128_MQL = smd 1.753 x 0.279: 1 -8.077,9.25; 2 -8.077,8.75; 3 -8.077,8.25; 4 -8.077,7.75; 5 -8.077,7.25; 6 -8.077,6.75; 7 -8.077,6.25; 8 -8.077,5.75; 9 -8.077,5.25; 10 -8.077,4.75; 11 -8.077,4.25; 12 -8.077,3.75; 13 -8.077,3.25; 14 -8.077,2.75; 15 -8.077,2.25; 16 -8.077,1.75; 17 -8.077,1.25; 18 -8.077,0.75; 19 -8.077,0.25; 20 -8.077,-0.25; 21 -8.077,-0.75; 22 -8.077,-1.25; 23 -8.077,-1.75; 24 -8.077,-2.25; 25 -8.077,-2.75; 26 -8.077,-3.25; 27 -8.077,-3.75; 28 -8.077,-4.25; 29 -8.077,-4.75; 30 -8.077,-5.25; 31 -8.077,-5.75; 32 -8.077,-6.25; 33 -8.077,-6.75; 34 -8.077,-7.25; 35 -8.077,-7.75; 36 -8.077,-8.25; 37 -8.077,-8.75; 38 -8.077,-9.25; 65 8.077,-9.25; 66 8.077,-8.75; 67 8.077,-8.25; 68 8.077,-7.75; 69 8.077,-7.25; 70 8.077,-6.75; 71 8.077,-6.25; 72 8.077,-5.75; 73 8.077,-5.25; 74 8.077,-4.75; 75 8.077,-4.25; 76 8.077,-3.75; 77 8.077,-3.25; 78 8.077,-2.75; 79 8.077,-2.25; 80 8.077,-1.75; 81 8.077,-1.25; 82 8.077,-0.75; 83 8.077,-0.25; 84 8.077,0.25; 85 8.077,0.75; 86 8.077,1.25; 87 8.077,1.75; 88 8.077,2.25; 89 8.077,2.75; 90 8.077,3.25; 91 8.077,3.75; 92 8.077,4.25; 93 8.077,4.75; 94 8.077,5.25; 95 8.077,5.75; 96 8.077,6.25; 97 8.077,6.75; 98 8.077,7.25; 99 8.077,7.75; 100 8.077,8.25; 101 8.077,8.75; 102 8.077,9.25 | smd 0.279 x 1.753: 39 -6.25,-11.074; 40 -5.75,-11.074; 41 -5.25,-11.074; 42 -4.75,-11.074; 43 -4.25,-11.074; 44 -3.75,-11.074; 45 -3.25,-11.074; 46 -2.75,-11.074; 47 -2.25,-11.074; 48 -1.75,-11.074; 49 -1.25,-11.074; 50 -0.75,-11.074; 51 -0.25,-11.074; 52 0.25,-11.074; 53 0.75,-11.074; 54 1.25,-11.074; 55 1.75,-11.074; 56 2.25,-11.074; 57 2.75,-11.074; 58 3.25,-11.074; 59 3.75,-11.074; 60 4.25,-11.074; 61 4.75,-11.074; 62 5.25,-11.074; 63 5.75,-11.074; 64 6.25,-11.074; 103 6.25,11.074; 104 5.75,11.074; 105 5.25,11.074; 106 4.75,11.074; 107 4.25,11.074; 108 3.75,11.074; 109 3.25,11.074; 110 2.75,11.074; 111 2.25,11.074; 112 1.75,11.074; 113 1.25,11.074; 114 0.75,11.074; 115 0.25,11.074; 116 -0.25,11.074; 117 -0.75,11.074; 118 -1.25,11.074; 119 -1.75,11.074; 120 -2.25,11.074; 121 -2.75,11.074; 122 -3.25,11.074; 123 -3.75,11.074; 124 -4.25,11.074; 125 -4.75,11.074; 126 -5.25,11.074; 127 -5.75,11.074; 128 -6.25,11.074
SOIC127P600X175-8N = smd 2.184 x 0.559: 1 -2.362,1.905; 2 -2.362,0.635; 3 -2.362,-0.635; 4 -2.362,-1.905; 5 2.362,-1.905; 6 2.362,-0.635; 7 2.362,0.635; 8 2.362,1.905
SMD2.5X2 = smd 1 x 0.9: 1 -0.925,-0.775; 2 0.925,-0.775; 3 0.925,0.775; 4 -0.925,0.775

### Placement (x,y rotation side)
C1  15.75,13.5 90 bottom
C2  49.75,13.5 90 bottom
C3  17.53,57.14 90 bottom
C4  15.62,57.14 90 bottom
C5  54.75,13.5 270 bottom
C6  29.25,13.5 270 bottom
C7  13.97,49.6 180 top
C8  13.97,47.94 180 top
C9  18.23,46.35 270 top
C10  19.68,60.64 90 top
C11  27.62,49.85 90 top
C12  29.01,59.05 90 top
C13  30.48,53.34 90 top
C14  30.48,67.4 90 top
C15  49.21,62.87 0 bottom
C16  51,47.62 180 bottom
C17  46.4,76.2 90 bottom
C18  51,52.07 180 bottom
C19  18.1,74.3 90 bottom
C20  27.3,68.22 0 top
C21  27.3,80.28 0 top
C22  59.05,75.25 0 top
C23  71.75,69.53 270 bottom
C24  55.88,75.25 180 top
C25  65.41,49.53 270 bottom
C26  55.24,65.16 0 bottom
C27  51,50.16 0 bottom
C28  67.63,70.17 90 bottom
C29  58.42,49.53 270 bottom
C30  59.05,54.61 90 bottom
C31  65.41,54.29 270 bottom
C32  53.98,73.34 0 bottom
C33  60.01,63.18 90 bottom
C34  59.05,57.47 180 bottom
C35  60.96,54.61 90 bottom
C36  53.98,60.96 270 bottom
C37  59.05,60.33 180 bottom
C38  63.82,61.59 270 bottom
C39  54.61,49.53 270 bottom
D1  16.51,61.28 90 top
D2  73.16,72.39 0 bottom
F1  16.75,53.5 180 bottom
J1  12.06,53.84 270 top
J2  25,23 0 top
J3  59,23 0 top
J4  40,23 90 bottom
J5  40,62 90 bottom
J6  13.97,73.66 270 top
JP1  4,4 0 top
JP2  82,4 0 top
JP3  4,86 0 top
JP4  82,86 0 top
L1  16.51,53.98 270 top
LED1  11,46.35 90 top
LED2  40,35.5 90 top
LED3  74,35.5 90 top
LED4  40,30 90 top
LED5  74,30 90 top
MP1  75.5,23 0 top
MP2  10.5,23 0 top
MP3  75.5,62 0 top
MP4  10.5,62 0 top
R1  20.45,17.78 90 bottom
R2  60.58,17.78 90 bottom
R3  13.99,46.35 0 top
R4  63.62,17.78 90 bottom
R5  62.09,17.78 90 bottom
R6  23.5,17.78 90 bottom
R7  21.98,17.78 90 bottom
R8  59.05,17.78 90 bottom
R9  28.05,17.78 90 bottom
R10  56.02,17.78 90 bottom
R11  57.53,17.78 90 bottom
R12  25.02,17.78 90 bottom
R13  26.54,17.78 90 bottom
R14  54.49,17.78 90 bottom
R15  29.57,17.78 90 bottom
R16  40,34 180 top
R17  73.9,33.7 180 top
R18  40,32 180 top
R19  73.9,31.8 180 top
R20  47.94,61.28 180 top
R21  46.67,46.04 180 top
R22  47.94,64.14 180 top
R23  46.67,48.58 180 top
R24  46.37,75.05 180 top
R25  46.67,50.8 180 top
R26  46.37,77.68 180 top
R27  46.67,53.02 180 top
R28  13.65,73.03 0 bottom
R29  13.65,75.25 0 bottom
R30  27.3,72.98 0 top
R31  27.3,69.8 0 top
R32  27.3,78.06 0 top
R33  27.3,74.88 0 top
R34  73.66,69.53 270 bottom
R35  51.12,59.05 90 bottom
R36  63.43,75.88 90 top
R37  61.91,75.88 90 top
R38  62.23,70.8 0 bottom
R39  70.48,51.48 180 bottom
R40  62.23,69.22 0 bottom
R41  70.48,54.02 180 bottom
R42  70.48,56.55 180 bottom
R43  70.48,48.94 180 bottom
T1  38.3,71.33 180 top
T2  38.53,52.75 0 top
T3  41.42,11.98 90 top
TP1  74.5,56.55 0 top
TP2  74.5,54.02 0 top
TP3  74.5,51.48 0 top
TP4  74.5,48.94 0 top
TP5  74.5,46.75 0 top
U1  23.18,50.16 90 top
U2  24.45,59.05 90 top
U3  61.59,59.69 0 top
U4  55.88,68.9 180 bottom
U$2  CC-BY-NC-SA  [CC-BY-NC-SA]  10.3,33.66 90 top
U$3  CC-BY-NC-SA  [CC-BY-NC-SA]  74.81,71.66 90 top
U$4  EXMACHINA-LOGO-NAME  [EXM-LOGO-BASELINE]  43.52,61.92 180 top
U$5  [A5L-LOC]  -31.5,-28.5 0 top  (outside the outline)
X1  57.47,77.47 180 top

### Tracks (layer width: path | path; a pad name or v marks a point on that pad's centre or on a via)
+1V8  (via drill 0.5)
  Top 0.254: U3.117 60.84,69.1 v60.01,68.26 | U3.89 65.51,62.44 v65.41,62.55 | U3.50 60.84,51.32 v60.96,51.44 | U3.43 57.34,50.99 v58.42,52.07 | U3.31 56.48,53.94 v56.52,53.98 | U3.41 56.34,50.63 v56.52,50.8 | U3.15 56.49,61.94 v56.52,61.91 | U3.125 56.84,73.33 v56.83,73.34 57.84,72.33 U3.123 | U3.3 v55.88,67.94
  Bottom 0.406: C32.1 v56.83,73.34 | C30.1 59.05,52.7 v58.42,52.07 C29.1 | C35.1 v60.96,51.44 | C39.1 56.09,50.38 v56.52,50.8 | C38.1 65.3,62.45 v65.41,62.55 | C33.1 59.59,61.91 v56.52,61.91 54.08,61.91 C36.1
  other vias: 28.62,54.74 28.62,56.33
  pour Top: 25.72,59.05 29.71,59.05 29.71,53.86 29.5,53.75 26.83,53.75 25.72,54.86
  pour Route15: 25.4,58.42 25.4,53.34 53.98,53.34 53.98,49.53 61.59,49.53 62.23,50.16 62.23,53.98 57.78,53.98 55.24,56.52 55.24,61.59 67.31,61.59 67.31,63.18 55.24,63.18 55.24,66.67 60.96,66.67 60.96,69.85 57.78,69.85 57.78,74.3 53.34,74.3 52.7,73.66 52.7,59.05 52.07,58.42
+3V3  (via drill 0.5)  (1 unrouted)
  Top 0.254: U3.9 55.08,64.94 v56.2,63.82 | U3.100 v67.63,67.94 | U3.77 65.48,56.44 v65.41,56.52 | U3.59 65.34,51.69 v65.41,51.75 | U3.24 56.49,57.44 v56.52,57.47 | U3.18 56.4,60.44 v56.52,60.33 | U3.37 52.21,50.94 52.07,50.8 v52.07,48.9
  Top 0.406: v64.7,76.52 63.4,76.52 63.4,76.7 R36.2 | R37.2 61.7,76.52 v60.64,76.52 | T2.2 35.35,50.59 v35.56,50.8 | T2.7 41.7,50.59 v41.91,50.8 | C13.+ v30.48,50.16 | T1.2 41.47,76.94 v41.59,77.06 | R16.2 37.62,34 v37.56,34.06 | R18.2 v37.65,32 37.56,31.91 | v71.43,33.8 72.95,33.8 R17.2 | v71.53,31.81 73.04,31.81 R19.2 | C14.+ 29.25,66 v28.75,65.5 | T1.7 35.12,77.78 v35.24,77.9
  Route15 0.406: v36.83,27.64 36.83,32.5 | 36.83,32.5 36.83,33.33 | 36.83,33.33 v37.56,34.06 | v71.53,31.81 71.43,31.91 v71.43,33.8 71.43,37.07 70.5,38 38.5,38 36.83,36.33 36.83,33.33 | v37.65,32 37.33,32 36.83,32.5
  Bottom 0.254: J5.1 36,59.75 v35.75,59.5
  Bottom 0.305: v36.83,27.64 36.83,26.64 37.35,26.12 J4.1
  Bottom 0.406: C26.1 v57.47,65.16 | R34.2 v73.66,67.63 | U4.8 59.05,66.99 59.37,66.67 v59.37,65.72 | C28.1 v67.63,67.94 | C37.1 v56.52,60.33 | C34.1 v56.52,57.47 | C31.1 v65.41,56.52 | C25.1 v65.41,51.75 | R28.1 v16.19,73.03 16.32,72.89 C19.+ | R29.1 v16.19,75.25 | D2.C 74.61,74.32 v74.31,74.61 | C27.1 52.07,49.95 v52.07,48.9
  other vias: 27.62,47.31 27.62,45.72
  pour Route15 (rank 2): -5.08,-5.08 90.17,-5.08 90.17,93.98 -5.08,93.98
  pour Top: 24.45,49.53 24.45,45.09 28.57,45.09 28.57,49.53
+5V
  pour Top (rank 2): 13.97,45.72 14.29,60.33 23.18,60.33 23.18,54.61 20.95,54.61 20.95,48.9 21.59,48.9 21.59,45.72 19.93,45.71 19.14,46.5 17,46.5 16.22,45.72
AGND  (via drill 0.5)  (1 unrouted)
  Top 0.406: v8,47 v10.5,44.5 v21,44.5 v31,44.5 v41,44.5 v51,44.5 v61,44.5 v75,44.5 v77.5,47 v77.5,56.5 v77.5,66.5 v77.5,76.5 v72.5,81.5 v58.5,81.5 v48.5,81.5 v38.5,81.5 v28.5,81.5 v8.5,81.5 8,81 v8,76.5 v8,66.5 v8,56.5 v8,47 | v11,39.5 10.5,39.5 v8,37 v8,31 v8,17.5 v8,11.5 v11,8.5 v20,8.5 v30,8.5 v40,8.5 v50,8.5 v60.5,8.5 v70,8.5 v77.5,16 v77.5,18.5 v77.5,31 v77.5,37 v75,39.5 v71,39.5 v61,39.5 v51,39.5 v41,39.5 v31,39.5 v21,39.5 v11,39.5
  Route2 0.406: J6.S1 28.46,81.54 v28.5,81.5 v72.5,81.5 v77.5,76.5 v77.5,47 v75,44.5 v10.5,44.5 v8,47 8,81 v8.5,81.5 17,81.5 | 50.11,8.61 v50,8.5 | v50,8.5 v11,8.5 v8,11.5 v8,37 10.5,39.5 v75,39.5 v77.5,37 v77.5,16 v70,8.5 v50,8.5
  Route15 0.406: J6.S1 28.46,81.54 v28.5,81.5 v72.5,81.5 v77.5,76.5 v77.5,47 v75,44.5 v10.5,44.5 v8,47 8,81 v8.5,81.5 17,81.5 | 50.11,8.61 v50,8.5 | v50,8.5 v11,8.5 v8,11.5 v8,37 10.5,39.5 v75,39.5 v77.5,37 v77.5,16 v70,8.5 v50,8.5
  Bottom 0.406: J3.G 50.18,12.46 49.82,12.1 C2.1 49.75,8.75 v50,8.5 | 77.5,64 v77.5,56.5 v77.5,47 v75,44.5 v61,44.5 v51,44.5 v41,44.5 v31,44.5 v21,44.5 v10.5,44.5 v8,47 v8,56.5 8,62 | 77.5,64 v77.5,66.5 v77.5,76.5 v72.5,81.5 v58.5,81.5 v48.5,81.5 v38.5,81.5 v28.5,81.5 28.46,81.54 J6.S1 | 8,66 v8,66.5 v8,76.5 8,81 v8.5,81.5 17,81.5 | 8,66 8,62 | J6.S2 8.21,65.79 8,66 | 50.11,8.61 v50,8.5 | 18,8.5 v11,8.5 v8,11.5 v8,17.5 8,20.5 | 18,8.5 v20,8.5 v30,8.5 v40,8.5 v50,8.5 | v50,8.5 v60.5,8.5 v70,8.5 v77.5,16 v77.5,18.5 77.5,24 | 77.5,24 v77.5,31 v77.5,37 v75,39.5 v71,39.5 v61,39.5 v51,39.5 v41,39.5 v31,39.5 v21,39.5 v11,39.5 10.5,39.5 v8,37 v8,31 8,20.5 | 18,8.5 18.4,8.9 J2.G 18.04,12.1 C1.1 | MP2.1 8,20.5 | MP1.1 76.5,23 77.5,24 | MP3.1 77.5,64 | MP4.1 8,62
CT_1  (via drill 0.35)  (1 unrouted)
  Top 0.178: T1.10 35.12,68.14 v35.56,68.58 40.32,68.58 41.47,67.43 T1.15
  Bottom 0.15: J4.10 36.75,20.75 35.05,19.05 30,19.05 R15.2
  Bottom 0.178: J5.10 36.25,64.25 35.56,64.94 v35.56,68.58
CT_2  (via drill 0.35)  (1 unrouted)
  Top 0.15: 44.75,20.75 44.75,24.5
  Top 0.178: T2.15 35.35,55.27 35.88,54.74 v41.27,54.74 41.7,55.17 T2.10 | 44.75,20.75 v46.45,19.05 | 44.75,24.5 v43.75,25.5
  Bottom 0.15: v46.45,19.05 46.87,18.63 R14.2
  Bottom 0.178: v41.27,54.74 43,54.74 43.75,55.49 43.75,59.25 43.25,59.75 J5.11 | v43.75,25.5 43.5,25.25 J4.11
GND  (via drill 0.35, 0.5)  (1 unrouted)
  Top 0.406: v44.5,19.25 v44.5,13
  Bottom 0.15: J5.20 44.25,64.25 46.33,66.33 v46.33,66.5
  Bottom 0.305: J4.20 43.75,20.75 44.5,20 v44.5,19.25
  Bottom 0.406: C1.2 20.1,14.9 22.9,12.1 C6.2 43.6,12.1 v44.5,13 46.4,14.9 C2.2 52.1,14.9 54.75,12.25 C5.2
  pour Bottom: -3.81,-3.81 88.9,-3.81 88.9,92.71 -3.81,92.71
  pour Route2: -6.35,-6.35 91.44,-6.35 91.44,95.25 -6.35,95.25
  pour Top (rank 6): -7.62,-7.62 92.71,-7.62 92.71,96.52 -7.5,96.52 -7.5,95
ISET  (via drill 0.35)
  Top 0.178: U3.17 53.5,60.96 v51.12,60.96
  Bottom 0.178: v51.12,60.96 R35.2
L1-1  (via drill 0.35)  (1 unrouted)
  Top 0.15: LED2.C 35.5,35.5 34.61,34.61 34.61,23.39 v35,23
  Top 0.178: U3.102 70.44,68.94 70.75,69.25 70.75,71.75 68.51,73.99 v68.51,75.88
  Bottom 0.15: v35,23 36.25,21.75 J4.8
  Bottom 0.178: v68.51,75.88 51.88,75.88 50.5,74.5 50.5,71.5 49.94,70.94 45.9,70.94 43.81,73.03 33.97,73.03 32.7,71.75 32.7,64.26 33.72,63.25 J5.8
L1-2  (via drill 0.35)  (1 unrouted)
  Top 0.15: LED4.C 36.22,30 35.74,29.53 35.74,22.51 35.75,22.5 v35.75,21.25
  Top 0.178: U3.101 70.94,68.44 71.25,68.75 71.25,74 70.64,74.61 v70.17,74.61
  Bottom 0.15: v35.75,21.25 J4.9
  Bottom 0.178: v70.17,74.61 52.11,74.61 51.5,74 51.5,71 50.48,69.98 45.59,69.98 43.5,72.07 34.29,72.07 33.66,71.44 33.66,63.95 33.85,63.75 J5.9
L2-1  (via drill 0.35)  (1 unrouted)
  Top 0.15: v46.72,32.38 46.72,23.22 v46.5,23
  Top 0.178: v50.53,36.83 72.5,36.83 73.25,36.08 LED3.C | v71.75,76.52 71.75,67.13 71.07,66.44 U3.97 | v47,67.75 v47,72.21
  Bottom 0.15: 45,22.5 46,22.5 v46.5,23
  Bottom 0.178: v50.53,36.83 50.53,36.2 v46.72,32.38 | v71.75,76.52 71.12,77.15 51.75,77.15 47,72.4 v47,72.21 | 46.25,22.75 v46.5,23 | J4.18 44.25,21.75 45,22.5 | J5.18 45.75,63.25 47,64.5 v47,67.75
L2-2  (via drill 0.35)  (1 unrouted)
  Top 0.178: v72.39,78.11 72.39,66.81 71.52,65.94 U3.96 | v45.5,21.5 45.5,25.77 45.77,26.04 45.77,33.34 48.62,36.2 69.58,36.2 70.22,35.56 70.22,30.84 71.06,30 LED5.C | v45.75,64.5 v45.75,72.75
  Bottom 0.178: v72.39,78.11 51.44,78.11 46.08,72.75 v45.75,72.75 | J5.19 45,63.75 v45.75,64.5 | J4.19 45.25,21.25 v45.5,21.5
L3-1  (via drill 0.35, 0.5)
  Top 0.15: v16.19,70.17 9.36,70.17 J6.L2
  Top 0.178: v63.13,79.38 64.12,79.38 66.33,77.17 66.34,77.17 66.84,76.67 U3.105
  Bottom 0.15: 28.26,67.31 19.05,67.31 v16.19,70.17
  Bottom 0.178: v63.13,79.38 30.8,79.38 29.84,78.42 29.84,68.9 28.26,67.31
L3-2  (via drill 0.35)
  Top 0.15: J6.L4 9.55,79.98 12.38,77.15 v16.83,77.15
  Top 0.178: v64.14,80.64 65.36,80.64 67.34,78.66 U3.104
  Bottom 0.15: 30.8,80.64 20.32,80.64 v16.83,77.15
  Bottom 0.178: v64.14,80.64 30.8,80.64
N$1
  cutout Top: 4,41 82,41 82,6 4,6
  cutout Bottom: 2.5,4.5 83.5,4.5 83.5,42.5 2.5,42.5
  cutout Route2: 3.5,5.5 82.5,5.5 82.5,41.5 3.5,41.5
  cutout Route15: 3,5 83,5 83,42 3,42
N$2
  Bottom 0.406: F1.1 15.35,53.9 14.14,55.11 J1.2
N$4
  cutout Top: 45,71.25 45,52.75 32,52.75 32,71.25
  cutout Bottom: 32,71.25 32,52.75 45,52.75 45,71.25
N$5
  Bottom 0.15: 63.45,21.85 63.45,18.8 R4.2
  Bottom 0.178: 63.5,27.62 63.47,27.62 J3.8 63.45,21.85
N$7  (via drill 0.35)
  Top 0.15: v20.95,20.64 24.11,23.8 24.36,24.05 J2.4
  Bottom 0.15: v20.95,20.64 20.45,20.14 R1.2
N$8  (via drill 0.35)
  Top 0.15: 26.67,25.72 27.3,26.35 28.89,26.35 29.21,26.67 29.45,26.91 J2.8
  Top 0.178: v26.54,22.23 26.67,22.36 26.67,25.72
  Bottom 0.15: R6.2 23.5,21.27 24.45,22.23 v26.54,22.23
N$9  (via drill 0.35)
  Top 0.15: v27.94,21.27 27.94,24.87 J2.7
  Bottom 0.15: v27.94,21.27 27.94,18.75 R9.2
N$10  (via drill 0.35)
  Top 0.15: R20.1 v49.85,61.28 | R22.1 v49.85,64.14
  Bottom 0.178: v49.85,61.28 50.06,61.49 C15.1 50.06,63.92 v49.85,64.14
N$11  (via drill 0.35)
  Top 0.15: v25.39,21.26 25.64,21.51 J2.5
  Bottom 0.15: v25.39,21.26 25.02,20.89 R12.2
N$12
  Bottom 0.15: R8.2 59.05,21.59 | 59.69,22.23 61.28,22.23 62.17,23.12 J3.7
  Bottom 0.178: 59.05,21.59 59.69,22.23
N$13
  Bottom 0.15: C5.1 54.49,15.15 54.49,15.5 | 54.49,15.5 R14.1 | R5.1 62.09,16.09 61.5,15.5 58,15.5 57.53,15.96 R11.1 57.53,16.04 57,15.5 54.49,15.5
N$14
  Bottom 0.15: R1.1 21.98,18.45 R7.2 23.5,17.11 R6.1
N$15  (via drill 0.35)
  Top 0.15: J3.4 58.37,23.23 v60.33,21.27
  Bottom 0.15: v60.33,21.27 60.58,21.02 R2.2
N$16
  Bottom 0.15: R2.1 62.09,18.45 R5.2 63.62,17.11 R4.1
N$17
  Bottom 0.15: R12.1 25.02,17.11 R13.2 28.05,17.11 R9.1
N$18
  Bottom 0.15: J3.5 59.63,22.94 59.05,22.36 56.83,22.36 | 56.52,22.04 56.02,21.54 R10.2
  Bottom 0.178: 56.52,22.04 56.83,22.36
N$19
  Bottom 0.15: R10.1 57.53,18.45 R11.2 59.05,17.11 R8.1
N$20
  Top 0.15: LED2.A 40.75,34.1 R16.1
N$23
  Top 0.406: LED1.A R3.1
N$27  (via drill 0.35)
  Top 0.15: C20.1 R31.1 v25.4,69.8 | R30.1 v25.4,72.98
  Bottom 0.15: v25.4,72.98 v25.4,69.8
N$28
  Top 0.15: R18.1 40.85,30.1 LED4.A
N$29
  Top 0.178: R17.1 LED3.A
N$30
  Top 0.178: LED5.A R19.1
N$31  (via drill 0.35)
  Top 0.15: C21.1 R32.1 v25.4,78.06 | R33.1 v25.4,74.88
  Bottom 0.15: v25.4,74.88 v25.4,78.06
N$32
  Bottom 0.15: R7.1 21.98,16.02 22.5,15.5 26,15.5 26.54,16.04 R13.1 26.54,15.96 27,15.5 29.57,15.5 | 29.57,15.5 R15.1 | C6.1 29.25,15.18 29.57,15.5
N$33  (via drill 0.35)
  Top 0.15: 47.1,77.68 R26.1 48.27,77.68 v48.31,77.72 | 45.42,74 v45.4,73.98
  Top 0.178: R24.1 46.8,75.05 46.5,74.75 46.5,74.25 46.25,74 45.42,74
  Bottom 0.178: v45.4,73.98 46.4,74.98 C17.1 47.35,75.35 48.31,76.31 v48.31,77.72
N$34
  Bottom 0.254: R29.2 11.11,75.25 10.59,75.77 J6.L3
N$35
  Bottom 0.254: R28.2 12.06,73.03 10.59,71.55 J6.L1
N$40  (via drill 0.35)
  Top 0.15: R23.1 v48.58,48.58 | R21.1 v48.58,46.04
  Bottom 0.15: v48.58,48.58 49,48.58 | v48.58,46.04 49.95,47.41
  Bottom 0.178: v48.58,48.58 49.2,48.58 C16.1 49.95,47.41
N$41  (via drill 0.35)
  Top 0.15: R25.1 v48.9,50.8 | R27.1 47.62,53.12 v47.62,54.29
  Bottom 0.15: v47.62,54.29 48.58,54.29
  Bottom 0.178: v48.9,50.8 48.9,51.4 49.57,52.07 C18.1 50.15,52.72 48.58,54.29
PS0
  Top 0.178: U3.114 62.34,74.05 61.91,74.48 R37.1
PS1
  Top 0.15: U3.113 62.84,74.09 63.43,74.68 R36.1
PW  (via drill 0.5)
  Bottom 0.406: C4.1 15.41,56.5 | C4.1 C3.1 18.15,55.67 F1.2 | v13,57.5 14.21,56.29 C4.1
  pour Top: 10.16,60.33 18.1,60.33 18.1,53.34 10.16,53.34
RST_N  (via drill 0.35)
  Top 0.178: U3.115 61.84,72.78 v61.59,73.03
  Bottom 0.178: C23.1 71.86,70.49 71.71,70.64 D2.A | R34.1 C23.1 | C23.1 71.65,70.48 70.48,70.48 67.94,73.03 v61.59,73.03
RX1_ISO_N  (via drill 0.35)
  Top 0.15: U3.11 51.1,63.94 48.11,66.93 48.11,76 47.76,76.35 45,76.35 | v33.97,77.2 33.85,77.08 T1.8 | 45,76.35 44.44,76.35 43.04,77.75 38.5,77.75 38.12,77.37 v37.47,77.37 | R24.2 45.52,75.83 45,76.35
  Bottom 0.15: v33.97,77.2 37.3,77.2 v37.47,77.37
RX1_ISO_P
  Top 0.15: U3.10 51.02,64.44 48.41,67.06 48.41,76.13 47.89,76.65 45,76.65 | T1.6 36.39,77.71 36.83,78.15 43.06,78.15 44.56,76.65 45,76.65 | R26.2 45.52,77.17 45,76.65
RX1_N  (via drill 0.35)  (1 unrouted)
  Top 0.15: T1.9 33.85,66.5 34.85,65.5 34.85,63.56 33.6,62.31 v33.6,61.44
  Bottom 0.15: J2.2 21.82,30.61 22.06,30.85 34.35,30.85 34.85,30.35 34.85,25.19 35.69,24.35 36.5,24.35 36.6,24.25 J4.3 | v33.6,61.44 34.29,60.75 J5.3
RX1_P  (via drill 0.35)  (1 unrouted)
  Top 0.15: T1.11 36.39,66.74 35.15,65.5 35.15,63.44 34.25,62.54 v34.25,60
  Bottom 0.15: J2.1 20.55,29.77 21.94,31.15 34.65,31.15 35.15,30.65 35.15,25.31 35.81,24.65 36.5,24.65 36.6,24.75 J4.2 | v34.25,60 34.5,60.25 J5.2
RX2_ISO_N
  Top 0.15: T2.8 42.98,50.37 44.36,51.75 45.72,51.75 | U3.20 51.08,59.44 49.36,57.72 49.36,52.54 48.58,51.75 45.72,51.75 | R25.2 45.82,51.65 45.72,51.75
RX2_ISO_P
  Top 0.15: T2.6 40.44,50.81 41.7,52.07 45.72,52.07 | U3.19 51.16,59.94 49.06,57.85 49.06,52.87 48.26,52.07 45.72,52.07 | R27.2 45.82,52.17 45.72,52.07
RX2_N  (via drill 0.35)  (1 unrouted)
  Top 0.15: v45.5,60.75 45.5,59.5 44.5,58.5 43.5,58.5 42.98,57.98 T2.9
  Bottom 0.15: J5.13 v45.5,60.75 | J3.2 55.83,28.38 55.35,28.85 53,28.85 arc-90 52.44,29.41 52.44,29.66 arc90 52.17,29.92 52.07,29.92 arc90 51.8,29.66 51.8,28.04 arc-90 51.54,27.78 51.43,27.78 arc-90 51.17,28.04 51.17,29.66 arc90 50.91,29.92 50.8,29.92 arc90 50.54,29.66 50.54,29.41 arc-90 49.98,28.85 46.56,28.85 45.65,27.94 45.65,25.94 44.06,24.35 43.5,24.35 43.4,24.25 J4.13
RX2_P  (via drill 0.35)  (1 unrouted)
  Top 0.15: T2.11 40.44,58.44 40.86,58.86 44.14,58.86 44.5,59.21 v44.5,59.75
  Bottom 0.15: J5.12 44,60.25 v44.5,59.75 | J3.1 55.11,25.11 57,27 57,28.5 56.35,29.15 53,29.15 arc-90 52.74,29.41 52.74,29.66 arc90 52.17,30.22 50.8,30.22 arc90 50.24,29.66 50.24,29.41 arc-90 49.98,29.15 46.44,29.15 45.35,28.06 45.35,26.06 43.94,24.65 43.5,24.65 43.4,24.75 J4.12
RX3_ISO_N
  Top 0.15: U3.5 52.23,66.94 50.65,68.52 50.65,78.83 49.47,80.01 33.07,80.01 29.38,76.32 28.57,76.32 | R33.2 28.16,75.9 28.57,76.32 | J6.R8 22.54,69.22 21.59,70.17 21.59,71.44 21.27,71.75 19.37,71.75 18.57,72.56 18.57,78.68 19.75,79.86 22.11,79.86 25.66,76.32 28.57,76.32
RX3_ISO_P
  Top 0.15: U3.4 52.15,67.44 50.95,68.64 50.95,78.97 49.59,80.33 32.75,80.33 29.04,76.62 28.57,76.62 | R32.2 28.16,77.04 28.57,76.62 | J6.R7 18.9,70.49 18.27,71.12 18.27,78.8 19.62,80.16 22.24,80.16 25.78,76.62 28.57,76.62
SCL  (via drill 0.35)
  Top 0.178: U3.110 64.34,67.73 v64.45,67.63
  Bottom 0.178: R41.1 69.22,54.02 68.58,54.65 68.58,65.41 67.94,66.04 65.41,66.04 64.45,66.99 v64.45,67.63 | 64.45,67.84 v64.45,67.63 | R40.1 64.14,69.22 64.45,68.9 v64.45,67.63
SCL_CPU  (via drill 0.35)
  Top 0.178: v73,54.02 TP2.TP
  Bottom 0.178: R41.2 v73,54.02
SCL_EEPROM
  Bottom 0.178: R40.2 60.33,69.22 60.01,69.53 U4.6
SDA  (via drill 0.35)
  Top 0.178: U3.111 63.84,68.61 v62.87,67.63
  Bottom 0.178: R39.1 68.58,51.48 67.63,52.43 67.63,64.77 67.31,65.09 65.09,65.09 62.87,67.31 v62.87,67.63 62.55,67.63 62.23,67.94 62.23,70.48 62.55,70.8 R38.1
SDA_CPU  (via drill 0.35)
  Top 0.178: v73,51.48 TP3.TP
  Bottom 0.178: R39.2 v73,51.48
SDA_EEPROM
  Bottom 0.178: R38.2 U4.5
SPIQ  (via drill 0.35)
  Top 0.178: U3.109 64.84,68.82 v66.04,67.63
  Bottom 0.178: R42.1 69.64,65.62 68.26,66.99 66.67,66.99 v66.04,67.63
SPIQ_CPU  (via drill 0.35)
  Top 0.178: v73,56.55 TP1.TP
  Bottom 0.178: R42.2 v73,56.55
SPIS-N  (via drill 0.35)
  Top 0.178: U3.112 63.34,69.69 v61.28,67.63
  Bottom 0.178: R43.1 67.94,48.94 66.67,50.2 66.67,63.82 66.36,64.14 63.82,64.14 61.28,66.67 v61.28,67.63
SPIS-N_CPU  (via drill 0.35)
  Top 0.178: v73,48.94 TP4.TP
  Bottom 0.178: R43.2 v73,48.94
TX1_ISO_N
  Top 0.15: T1.3 40.2,74.83 40.96,74.07 43.1,74.07 44.3,72.88 44.3,63.44 45.3,62.44 46.99,62.44 | U3.14 46.99,62.44 | R20.2 47.09,62.34 46.99,62.44
TX1_ISO_P
  Top 0.15: T1.1 42.74,74.83 43.18,74.39 43.21,74.39 44.6,73 44.6,63.56 45.22,62.94 46.99,62.94 | U3.13 46.99,62.94 | R22.2 47.09,63.04 46.99,62.94
TX1_N  (via drill 0.35)  (1 unrouted)
  Top 0.15: T1.14 40.2,66.65 41.35,65.5 41.35,63.06 40.44,62.15 36.35,62.15 v36,62.5
  Bottom 0.15: J2.6 26.91,28.65 27.11,28.85 29.25,28.85 arc90 29.81,29.41 arc-90 30.07,29.68 30.4,29.68 arc-90 30.66,29.41 30.66,28.29 arc90 30.93,28.02 31.26,28.02 arc90 31.52,28.29 31.52,29.41 arc-90 31.78,29.68 32.11,29.68 arc-90 32.38,29.41 arc90 32.94,28.85 33.35,28.44 33.35,25.44 35.94,22.85 36.5,22.85 36.6,22.75 J4.6 | J5.6 36.25,62.25 v36,62.5
TX1_P  (via drill 0.35)  (1 unrouted)
  Top 0.15: T1.16 42.74,66.59 41.65,65.5 41.65,62.94 40.56,61.85 35.35,61.85 v35,61.5
  Bottom 0.15: J2.3 24.24,26.25 25.5,26.25 25.75,26.5 25.75,28.25 26.65,29.15 29.25,29.15 arc90 29.51,29.41 arc-90 30.07,29.98 32.11,29.98 arc-90 32.67,29.41 arc90 32.94,29.15 33.06,29.15 33.65,28.56 33.65,25.56 36.06,23.15 36.5,23.15 36.6,23.25 J4.5 | J5.5 35.25,61.75 v35,61.5
TX2_ISO_N
  Top 0.15: U3.23 51.8,57.94 50.63,56.77 50.63,48.83 48.96,47.16 45.09,47.16 | R21.2 45.82,46.42 45.09,47.16 | T2.3 36.62,46.56 36.83,46.35 43.57,46.35 44.37,47.16 45.09,47.16
TX2_ISO_P  (via drill 0.35)
  Top 0.15: U3.22 51.88,58.44 50.33,56.9 50.33,48.96 48.83,47.46 45.09,47.46 | R23.2 45.82,48.2 45.09,47.46 | v34.09,47.33 T2.1 | 45.09,47.46 44.24,47.46 43.74,46.96 v38.27,46.96
  Bottom 0.15: v38.27,46.96 34.46,46.96 v34.09,47.33
TX2_N  (via drill 0.35)  (1 unrouted)
  Top 0.15: T2.14 36.62,58.62 37.25,59.25 42.71,59.25 45,61.54 v45,62
  Bottom 0.15: J5.16 44.75,62.25 v45,62 | J4.16 43.4,22.75 43.5,22.85 44.56,22.85 46.56,24.85 47,24.85 arc-90 47.26,24.59 47.26,24.4 arc90 47.83,23.83 48.95,23.83 arc90 49.51,24.4 49.51,24.59 arc-90 49.77,24.85 52.94,24.85 53.35,24.44 53.35,22.94 53.94,22.35 56.06,22.35 58.5,24.79 58.5,26 60.15,27.65 J3.6
TX2_P  (via drill 0.35)  (1 unrouted)
  Top 0.15: T2.16 34.09,58.09 34.5,58.5 36,58.5 37.25,59.75 42.79,59.75 43.75,60.71 v43.75,61.5
  Bottom 0.15: J5.15 43.5,61.75 v43.75,61.5 | J4.15 43.4,23.25 43.5,23.15 44.44,23.15 46.44,25.15 47,25.15 arc-90 47.56,24.59 47.56,24.4 arc90 47.83,24.13 47.85,24.13 arc90 48.11,24.4 48.11,25.9 arc-90 48.37,26.17 48.4,26.17 arc-90 48.66,25.9 48.66,24.4 arc90 48.92,24.13 48.95,24.13 arc90 49.21,24.4 49.21,24.59 arc-90 49.77,25.15 53.06,25.15 53.65,24.56 53.65,23.06 54.06,22.65 55.94,22.65 57.09,23.81 J3.3
TX3_ISO_N
  Top 0.15: U3.8 51.82,65.44 49.38,67.88 49.38,78.36 48.83,78.91 33.45,78.91 31.27,76.72 31.27,71.96 30.54,71.24 28.57,71.24 | 28.57,71.24 24.7,71.24 23.98,71.96 23.98,75.72 J6.R2 | R31.2 28.16,70.82 28.57,71.24
TX3_ISO_P
  Top 0.15: U3.7 51.75,65.94 49.68,68.01 49.68,78.48 48.96,79.21 33.32,79.21 30.96,76.85 30.96,72.09 30.42,71.54 28.57,71.54 | 28.57,71.54 24.83,71.54 24.28,72.09 24.28,77.03 23.21,78.11 J6.R1 | R30.2 28.16,71.96 28.57,71.54
X1
  Top 0.178: U3.121 58.84,74.61 C22.1 58.2,75.46 57.47,76.2 57.47,77.47 58.24,78.25 X1.1
X2
  Top 0.178: 57.08,74.9 C24.1 | C24.1 56.73,76.51 X1.3 | U3.122 58.34,73.42 56.73,75.03 C24.1

### Text on the board
Top: 1
Route2: 2
Route15: 3
Bottom: 4
tPlace: ETH3 | SwitchEthernet / Rev A6 | +5V / 250mA | SwitchEthernet / Rev A6